# Altium project PFC_Stage.PrjPcb (part 1 of 3)
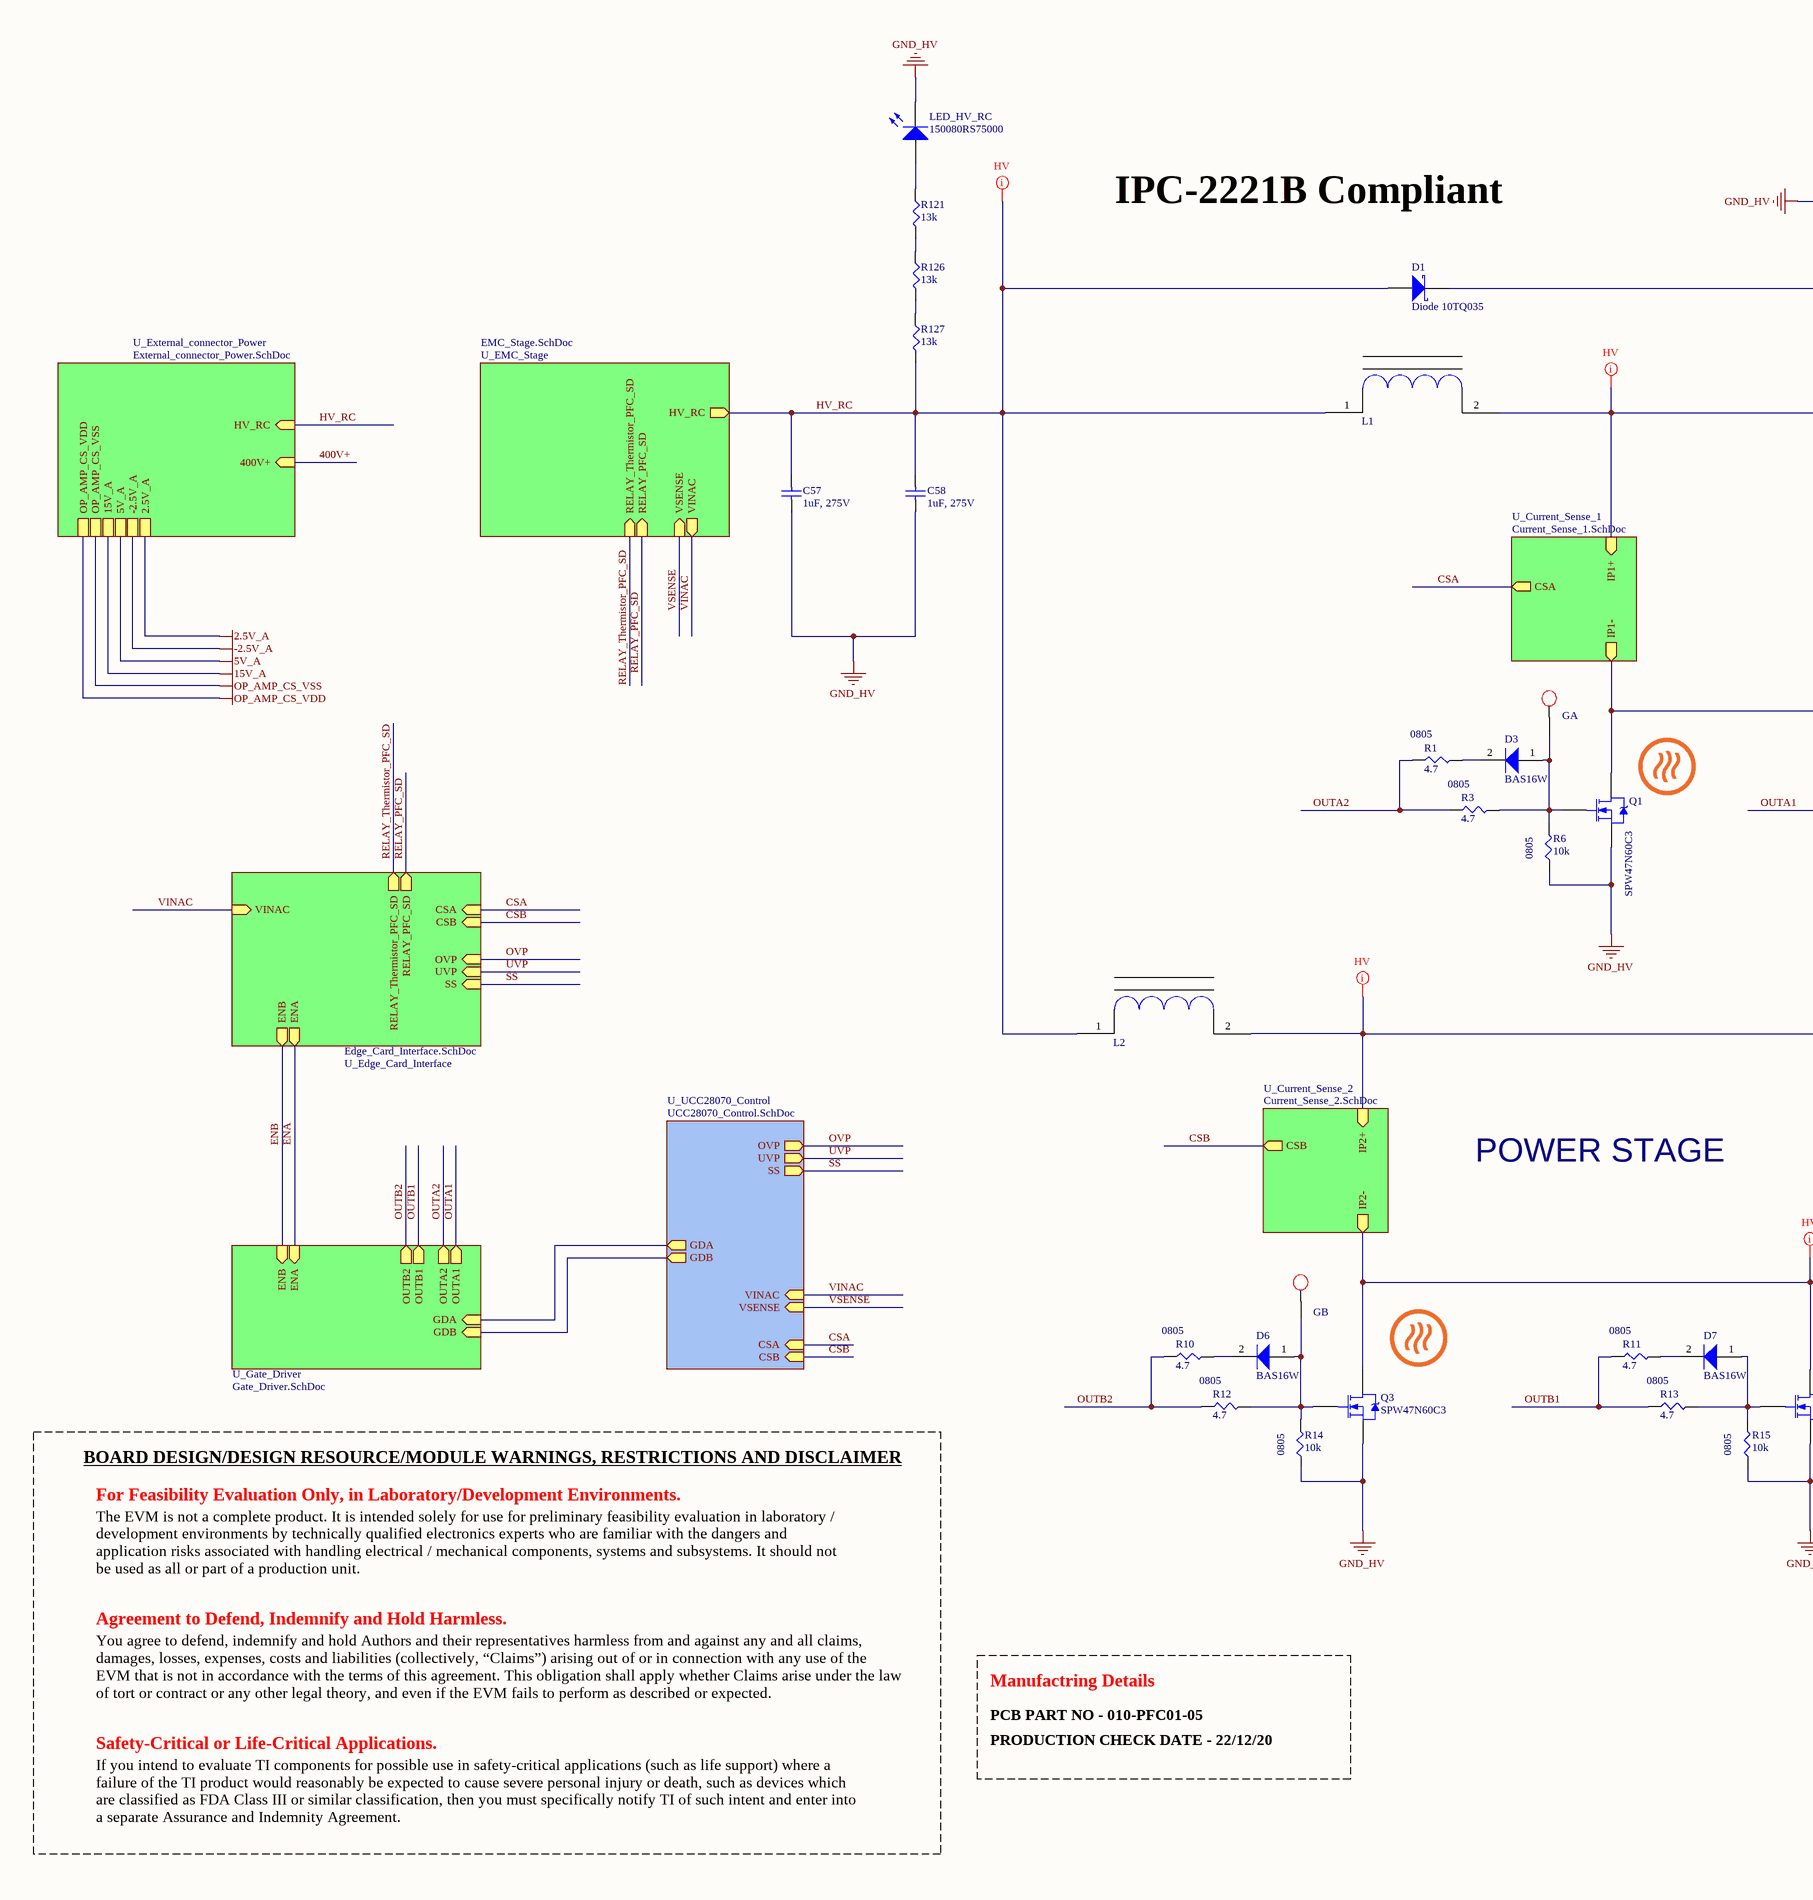
[diagram p0: PFC_Stage.SchDoc, left]
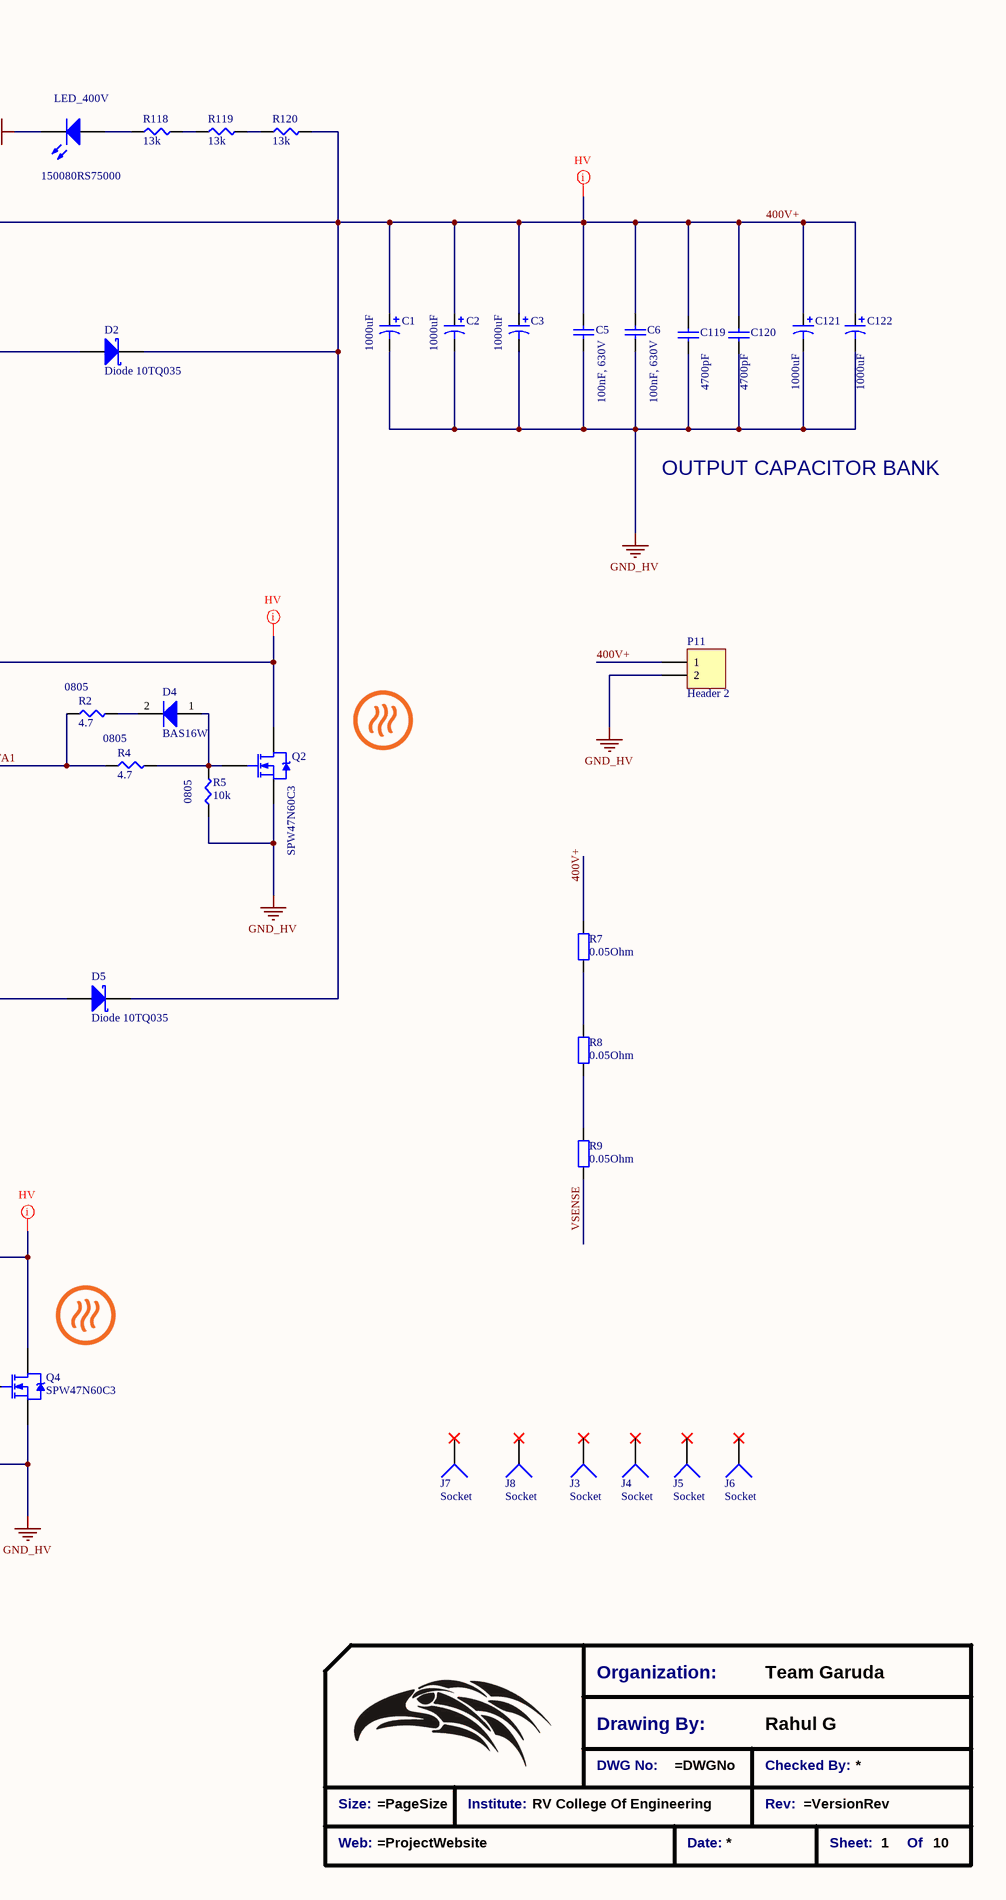
[diagram p1: PFC_Stage.SchDoc, right]
10 sheets, 562 parts. Net scope: hierarchical (ports join the sheet entries above them; power ports are global).
Board file: PFC_Stage.PcbDoc
Sheets:
  PFC_Stage.SchDoc
    U_UCC28070_Control = UCC28070_Control.SchDoc
      U_Shut_Down = Shut_Down.SchDoc
    U_Current_Sense_1 = Current_Sense_1.SchDoc
    U_Current_Sense_2 = Current_Sense_2.SchDoc
    U_Gate_Driver = Gate_Driver.SchDoc
    U_EMC_Stage = EMC_Stage.SchDoc
    U_External_connector_Power = External_connector_Power.SchDoc
    U_Edge_Card_Interface = Edge_Card_Interface.SchDoc
      U_AC mains Sensing = AC mains Sensing.SchDoc

## Sheet PFC_Stage.SchDoc
size A2; Author: Rahul G; DrawnBy: Rahul G; Engineer: Rahul G; DocumentNumber: 1; SheetNumber: 1; SheetTotal: 10

### Parts
*  Title_Block  (value not drawn)  (graphical)
C1  value 1000uF  [450V_40mm_10mm]  (hidden comment: 40mm)
C2  value 1000uF  [450V_40mm_10mm]  (hidden comment: 40mm)
C3  value 1000uF  [450V_40mm_10mm]  (hidden comment: 40mm)
C5  100nF, 630V  [L18_W6_H12_P15]
C6  100nF, 630V  [L18_W6_H12_P15]
C57  1uF, 275V  [L26_W11_H20_P22.5_CS]
C58  1uF, 275V  [L26_W11_H20_P22.5_CS]
C119  value 4700pF  [VY1472M61Y5UC63V0]  (hidden comment: VY1472M61Y5UC63V0)
C120  value 4700pF  [VY1472M61Y5UC63V0]  (hidden comment: VY1472M61Y5UC63V0)
C121  value 1000uF  [450V_40mm_10mm]  (hidden comment: 40mm)
C122  value 1000uF  [450V_40mm_10mm]  (hidden comment: 40mm)
D1  Diode 10TQ035  [INF-PG-TO247-2-MOD]
D2  Diode 10TQ035  [INF-PG-TO247-2-MOD]
D3  BAS16W  [SODFL250X110-2N]
D4  BAS16W  [SODFL250X110-2N]
D5  Diode 10TQ035  [INF-PG-TO247-2-MOD]
D6  BAS16W  [SODFL250X110-2N]
D7  BAS16W  [SODFL250X110-2N]
GA  Test Point  [Test_point_SMD]  (value not drawn)  (no BOM)
GB  Test Point  [Test_point_SMD]  (value not drawn)  (no BOM)
J3  Socket  [Mounting_hole_3mm]
J4  Socket  [Mounting_hole_3mm]
J5  Socket  [Mounting_hole_3mm]
J6  Socket  [Mounting_hole_3mm]
J7  Socket  [Mounting_hole_3mm_no_body]
J8  Socket  [Mounting_hole_3mm_no_body]
L1  Transformer_Inductor  [PFC_Toroid_MPP]  (value not drawn)
L2  Transformer_Inductor  [PFC_Toroid_MPP]  (value not drawn)
LED_400V  150080RS75000  [0805_A]
LED_HV_RC  150080RS75000  [0805_A]
P11  Header 2  [Barrier_Strip_2]
Q1  SPW47N60C3  [INF-PG-TO247-3-44]
Q2  SPW47N60C3  [INF-PG-TO247-3-44]
Q3  SPW47N60C3  [INF-PG-TO247-3-44]
Q4  SPW47N60C3  [INF-PG-TO247-3-44]
R1  4.7  Supplier Device Package: 0805  [SMD-0805-RES]
R2  4.7  Supplier Device Package: 0805  [SMD-0805-RES]
R3  4.7  Supplier Device Package: 0805  [SMD-0805-RES]
R4  4.7  Supplier Device Package: 0805  [SMD-0805-RES]
R5  10k  Supplier Device Package: 0805  [SMD-0805-RES]
R6  10k  Supplier Device Package: 0805  [SMD-0805-RES]
R7  0.05Ohm  [WRIS-KSKE_1206_H=0.6mm]
R8  0.05Ohm  [WRIS-KSKE_1206_H=0.6mm]
R9  0.05Ohm  [WRIS-KSKE_1206_H=0.6mm]
R10  4.7  Supplier Device Package: 0805  [SMD-0805-RES]
R11  4.7  Supplier Device Package: 0805  [SMD-0805-RES]
R12  4.7  Supplier Device Package: 0805  [SMD-0805-RES]
R13  4.7  Supplier Device Package: 0805  [SMD-0805-RES]
R14  10k  Supplier Device Package: 0805  [SMD-0805-RES]
R15  10k  Supplier Device Package: 0805  [SMD-0805-RES]
R118  13k  [SMD-2512-RES]
R119  13k  [SMD-2512-RES]
R120  13k  [SMD-2512-RES]
R121  13k  [SMD-2512-RES]
R126  13k  [SMD-2512-RES]
R127  13k  [SMD-2512-RES]

### Sub-sheets
U_Current_Sense_1 = Current_Sense_1.SchDoc: CSA (out), IP1+ (in), IP1- (out)
U_Current_Sense_2 = Current_Sense_2.SchDoc: CSB (out), IP2+ (in), IP2- (out)
U_Edge_Card_Interface = Edge_Card_Interface.SchDoc: OVP (in), UVP (in), CSA (in), CSB (in), SS (in), RELAY_PFC_SD (out), RELAY_Thermistor_PFC_SD (out), ENB (out), ENA (out), VINAC (in)
U_EMC_Stage = EMC_Stage.SchDoc: RELAY_PFC_SD (in), HV_RC (out), VINAC (out), VSENSE (in), RELAY_Thermistor_PFC_SD (in)
U_External_connector_Power = External_connector_Power.SchDoc: 400V+ (in), OP_AMP_CS_VDD, -2.5V_A, 15V_A, OP_AMP_CS_VSS, 5V_A, 2.5V_A, HV_RC (in)
U_Gate_Driver = Gate_Driver.SchDoc: GDB (in), GDA (in), ENB (in), ENA (in), OUTA2 (out), OUTB2 (out), OUTB1 (out), OUTA1 (out)
U_UCC28070_Control = UCC28070_Control.SchDoc: GDB (out), CSA (in), CSB (in), VINAC (in), GDA (out), VSENSE (in), OVP (out), UVP (out), SS (out)

### Nets
GND_HV: C1.2 C2.2 C3.2 C5.1 C6.1 C57.1 C58.1 C119.1 C120.1 C121.2 C122.2 LED_400V.1(K) LED_HV_RC.1(K) P11.2 Q1.3(S) Q2.3(S) Q3.3(S) Q4.3(S) R5.1 R6.1 R14.1 R15.1
400V+: C1.1 C2.1 C3.1 C5.2 C6.2 C119.2 C120.2 C121.1 C122.1 D1.1(K) D2.1(K) D5.1(K) P11.1 R7.2 R120.2 ; sheet U_External_connector_Power/400V+
CSA: sheet U_UCC28070_Control/CSA, sheet U_Current_Sense_1/CSA, sheet U_Edge_Card_Interface/CSA
CSB: sheet U_UCC28070_Control/CSB, sheet U_Current_Sense_2/CSB, sheet U_Edge_Card_Interface/CSB
ENA: sheet U_Gate_Driver/ENA, sheet U_Edge_Card_Interface/ENA
ENB: sheet U_Gate_Driver/ENB, sheet U_Edge_Card_Interface/ENB
GDA: sheet U_UCC28070_Control/GDA, sheet U_Gate_Driver/GDA
GDB: sheet U_UCC28070_Control/GDB, sheet U_Gate_Driver/GDB
HV_RC: C57.2 C58.2 D1.3(A) L1.1 L2.1 R127.2 ; sheet U_EMC_Stage/HV_RC, sheet U_External_connector_Power/HV_RC
OUTA1: R2.1 R4.1 ; sheet U_Gate_Driver/OUTA1
OUTA2: R1.1 R3.1 ; sheet U_Gate_Driver/OUTA2
OUTB1: R11.1 R13.1 ; sheet U_Gate_Driver/OUTB1
OUTB2: R10.1 R12.1 ; sheet U_Gate_Driver/OUTB2
OVP: sheet U_UCC28070_Control/OVP, sheet U_Edge_Card_Interface/OVP
RELAY_PFC_SD: sheet U_EMC_Stage/RELAY_PFC_SD, sheet U_Edge_Card_Interface/RELAY_PFC_SD
RELAY_Thermistor_PFC_SD: sheet U_EMC_Stage/RELAY_Thermistor_PFC_SD, sheet U_Edge_Card_Interface/RELAY_Thermistor_PFC_SD
SS: sheet U_UCC28070_Control/SS, sheet U_Edge_Card_Interface/SS
UVP: sheet U_UCC28070_Control/UVP, sheet U_Edge_Card_Interface/UVP
VINAC: sheet U_UCC28070_Control/VINAC, sheet U_EMC_Stage/VINAC, sheet U_Edge_Card_Interface/VINAC
VSENSE: R9.1 ; sheet U_UCC28070_Control/VSENSE, sheet U_EMC_Stage/VSENSE
NetD2_3: D2.3(A) L1.2 ; sheet U_Current_Sense_1/IP1+
NetD3_1: D3.1(A) GA.1 Q1.1(G) R3.2 R6.2
NetD3_2: D3.2(K) R1.2
NetD4_1: D4.1(A) Q2.1(G) R4.2 R5.2
NetD4_2: D4.2(K) R2.2
NetD5_3: D5.3(A) L2.2 ; sheet U_Current_Sense_2/IP2+
NetD6_1: D6.1(A) GB.1 Q3.1(G) R12.2 R14.2
NetD6_2: D6.2(K) R10.2
NetD7_1: D7.1(A) Q4.1(G) R13.2 R15.2
NetD7_2: D7.2(K) R11.2
NetLED_400V_2: LED_400V.2(A) R118.1
NetLED_HV_RC_2: LED_HV_RC.2(A) R121.1
NetQ1_2: Q1.2(D) Q2.2(D) ; sheet U_Current_Sense_1/IP1-
NetQ3_2: Q3.2(D) Q4.2(D) ; sheet U_Current_Sense_2/IP2-
NetR7_1: R7.1 R8.2
NetR8_1: R8.1 R9.2
NetR118_2: R118.2 R119.1
NetR119_2: R119.2 R120.1
NetR121_2: R121.2 R126.1
NetR126_2: R126.2 R127.1

Not connected (* = marked no-connect by the designer): J3 1*; J4 1*; J5 1*; J6 1*; J7 1*; J8 1*

### Layout directives
net class HV; rule Clearance Constraint [Generic clearance = 50mil, and 18 value(s) for objects]: 400V+, HV_RC, NetD2_3, NetD5_3, NetQ1_2, NetQ3_2

### Notes on the sheet
- IPC-2221B Compliant
- OUTPUT CAPACITOR BANK
- POWER STAGE
- BOARD DESIGN/DESIGN RESOURCE/MODULE WARNINGS, RESTRICTIONS AND DISCLAIMER
- For Feasibility Evaluation Only, in Laboratory/Development Environments.
- The EVM is not a complete product. It is intended solely for use for preliminary feasibility evaluation in laboratory / development environments by technically qualified electronics experts who are familiar with the dangers and application risks associated with handling electrical / mechanical components, systems and subsystems. It should not be used as all or part of a production unit.
- Agreement to Defend, Indemnify and Hold Harmless.
- You agree to defend, indemnify and hold Authors and their representatives harmless from and against any and all claims, damages, losses, expenses, costs and liabilities (collectively, “Claims”) arising out of or in connection with any use of the
  EVM that is not in accordance with the terms of this agreement. This obligation shall apply whether Claims arise under the law of tort or contract or any other legal theory, and even if the EVM fails to perform as described or expected.
- Manufactring Details
- PCB PART NO - 010-PFC01-05
- Safety-Critical or Life-Critical Applications.
- PRODUCTION CHECK DATE - 22/12/20
- If you intend to evaluate TI components for possible use in safety-critical applications (such as life support) where a failure of the TI product would reasonably be expected to cause severe personal injury or death, such as devices which are classified as FDA Class III or similar classification, then you must specifically notify TI of such intent and enter into a separate Assurance and Indemnity Agreement.
- (in symbol Title_Block) Organization:; Team Garuda; Drawing By:; DWG No:; Checked By:; Size:; Institute:; RV College Of Engineering; Rev:; Web:; Date:; Sheet:; Of

### Library data of the parts
* = Title_Block: Standard Title Block
C1-C3 C121 C122 = Cap Pol1: Polarized Capacitor (Radial); Published: 8-Jun-2000; LatestRevisionDate: 17-Jul-2002; LatestRevisionNote: Re-released for DXP Platform.; PackageReference: RB7.6-15; Publisher: Altium Limited; PackageDescription: Polarized Capacitor (Radial); 2 Leads
C5 C6 = 890303425004CS: WCAP-FTBE THT Film Capacitors, 100nF, 630VDC; Insulation Resistance: 9000MOhm; Dissipation Factor@100kHz: 3.2%; Dissipation Factor@1kHz: 1%; Dissipation Factor@10kHz: 1.4%; Pitch: 15mm; Rate of Voltage Rise: 28V/us; Technical Reference: MPSP015104K630DCPP45004; ComponentLink1Description: Manufacturer; ComponentLink1URL: http://www.we-online.de; ComponentLink2Description: Datasheet; ComponentLink2URL: https://katalog.we-online.com/pbs/datasheet/890303425004CS.pdf; Length: 18mm; Mounting Technology: THT; Packaging: Carton; Part Number: 890303425004CS; Operating Temperature: -40 to +85degC; Width: 6mm; Capacitance: 100nF; Height: 12mm; Rated Voltage: 630VDC; Publisher: Wurth Elektronik; Published Date: August 2019
C57 C58 = 890324026027CS: WCAP-FTX2 THT Film Capacitors, 1uF, 275VAC; Insulation Resistance: 10000Ohm x F; Dissipation Factor@1kHz: 0.1%; Dissipation Factor@10kHz: 0.7%; Pitch: 22.5mm; Rate of Voltage Rise: 170V/us; Technical Reference: MX2P225105K275ACPP36004; ComponentLink1Description: Manufacturer; ComponentLink1URL: http://www.we-online.de; ComponentLink2Description: Datasheet; ComponentLink2URL: https://katalog.we-online.com/pbs/datasheet/890324026027CS.pdf; Length: 26mm; Mounting Technology: THT; Packaging: Bulk and Carton; Part Number: 890324026027CS; Operating Temperature: -40 to +105degC; Width: 11mm; Capacitance: 1uF; Dissipation Factor@100kHz: -; Height: 20mm; Rated Voltage: 275VAC; Publisher: Wurth Elektronik; Published Date: August 2019
C119 C120 = VY1472M61Y5UC63V0: Capacitor; Published: 8-Jun-2000; LatestRevisionDate: 17-Jul-2002; LatestRevisionNote: Re-released for DXP Platform.; PackageReference: RAD-0.3; Publisher: Altium Limited; PackageDescription: Radial Cap, Thru-Hole; 2 Leads; 0.3 in Pin Spacing
D1 D2 D5 = Diode 10TQ035: Schottky Rectifier; Note: Terminal 2 is the TAB and is electrically connected to the cathode; Published: 8-Jun-2000; LatestRevisionDate: 17-Jul-2002; LatestRevisionNote: Re-released for DXP Platform.; DatasheetVersion: PD-2.057B; PackageVersion: Feb-1998; PackageReference: TO-220AC; Publisher: Altium Limited; PackageDescription: TO, Thru-Hole, Vertical, Heatsink Mounted; 3 In-Line Leads (1 Absent); Pitch 2.54 mm; ComponentLink1Description: Manufacturer Link; ComponentLink1URL: http://www.irf.com/; ComponentLink2Description: Datasheet; ComponentLink2URL: http://www.irf.com/product-info/datasheets/data/10tq.pdf
D3 D4 D6 D7 = BAS16_SOD: Silicon Switching Diode, SOT323, Reel, Green; Manufacturer: Infineon; IR (max): 100Â nA; Configuration: Single; VBR (min): 85Â V; VR (max): 80Â V; trr (max): 4Â ns; Green: TRUE; VF (max): 1.25Â V; IF (max): 250Â mA; Mounting Technology: Surface Mount; PackageReference: SOT323; ComponentLink2URL: http://www.infineon.com/dgdl/bas16series.pdf?folderId=db3a30431400ef6801141b5844e103ea&fileId=db3a30431400ef6801141b93811b03ff; Halogen-free: TRUE; ComponentLink2Description: Datasheet; PartNumber: BAS16W; ComponentLink1Description: Manufacturer URL; ComponentLink3URL: http://www.infineon.com/dgdl/SOT323-Package_Overview.pdf?folderId=db3a30431936bc4b0119533e1dcb3c92&fileId=db3a30431936bc4b011953495f283cb1; ComponentLink1URL: http://www.infineon.com/; PackageDescription: 3-Pin Small Outline Transistor Package, 1.25 x 2 mm Body, 0.65 mm Pitch; ComponentLink3Description: Package Specification
GA GB = Test Point: TP
LED_400V LED_HV_RC = 150080RS75000: SMD mono-color Chip LED, WL-SMCW, Red; PackageReference: 0805_A; Color: Red; PartNumber: 150080RS75000; ComponentLink1Description: Manufacturer URL; ComponentLink1URL: http://www.we-online.com; ComponentLink2Description: Datasheet; ComponentLink2URL: http://katalog.we-online.com/led/datasheet/150080RS75000.pdf
P11 = Header 2: Header, 2-Pin; LatestRevisionDate: 17-Jul-2002; LatestRevisionNote: Re-released for DXP Platform.; Publisher: Altium Limited
Q1-Q4 = NMOS-2: N-Channel Power MOSFET; Note: Pin 2 is electrically connected to pin 4.; Published: 8-Jun-2000; LatestRevisionDate: 17-Jul-2002; LatestRevisionNote: Re-released for DXP Platform.; DatasheetVersion: PD-9.814; PackageVersion: Feb-1997; PackageReference: TO-220AB; Publisher: Altium Limited; PackageDescription: TO, Thru-Hole, Vertical, Heatsink Mounted; 3 In-Line Leads; Pitch 2.54 mm; ComponentLink1Description: Manufacturer Link; ComponentLink1URL: http://www.irf.com/
R1-R4 R10-R13 = ERJ-6BQF4R7V: RES SMD 4.7 OHM 1% 1/3W 0805; Manufacturer: Panasonic Electronic Components; Factory Stock: 0; Unit Price (USD): 0.07013; @ qty: 1500; Minimum Quantity: 1; Power (Watts): 0.333W, 1/3W; Temperature Coefficient: ±200ppm/°C; Part Number: ERJ-6BQF4R7V; Datasheets: https://industrial.panasonic.com/cdbs/www-data/pdf/RDA0000/AOA0000C239.pdf; Image: //media.digikey.com/Renders/Panasonic%20Renders/ERJ-0805%20Pkg.jpg; Digi-Key Part Number: P15995CT-ND; Quantity Available: 9150; Packaging: Cut Tape (CT); Series: ERJ; Part Status: Active; Value: 4.7; Tolerance: ±1%; Composition: Thick Film; Features: Automotive AEC-Q200, Current Sense; Operating Temperature: -55°C ~ 125°C; Package / Case: 0805 (2012 Metric); Size / Dimension: 0.079" L x 0.049" W (2.00mm x 1.25mm); Height - Seated (Max): 0.028" (0.70mm); Number of Terminations: 2; Failure Rate: -
R5 R6 R14 R15 = ERJ-6ENF1002V: RES SMD 10K OHM 1% 1/8W 0805; Manufacturer: Panasonic Electronic Components; Factory Stock: 0; Unit Price (USD): 0.00729; @ qty: 1500; Minimum Quantity: 1; Power (Watts): 0.125W, 1/8W; Temperature Coefficient: ±100ppm/°C; Part Number: ERJ-6ENF1002V; Datasheets: http://industrial.panasonic.com/www-cgi/jvcr13pz.cgi?E+PZ+3+AOA0002+ERJ6ENF1002V+7+WW; Image: //media.digikey.com/Renders/Panasonic%20Renders/ERJ-0805%20Pkg.jpg; Digi-Key Part Number: P10.0KCCT-ND; Quantity Available: 3985614; Packaging: Cut Tape (CT); Series: ERJ; Part Status: Active; Value: 10k; Tolerance: ±1%; Composition: Thick Film; Features: Automotive AEC-Q200; Operating Temperature: -55°C ~ 155°C; Package / Case: 0805 (2012 Metric); Size / Dimension: 0.079" L x 0.049" W (2.00mm x 1.25mm); Height - Seated (Max): 0.028" (0.70mm); Number of Terminations: 2; Failure Rate: -
R7-R9 = 560050332001: WRIS-KSKE Thick Film Resistors, size 1206, 0.05Ohm, +/-1%, 0.5W; Rated Current: 3.16A; Temperature Coefficient of Resistance: 250ppm/degC; Technical Reference: KE1206R050F102LAATP0000; ComponentLink1Description: Manufacturer; ComponentLink1URL: http://www.we-online.de; ComponentLink2Description: Datasheet; ComponentLink2URL: https://katalog.we-online.com/pbs/datasheet/560050332001.pdf; Publisher: Wurth Elektronik; Rated Power: 0.5W; Resistance: 0.05Ohm; Mounting Technology: SMT; Height: 0.6mm; Part Number: 560050332001; Packaging: Tape and Reel; Published Date: September 2019; Size: 1206; Length: 3.1mm; Operating Temperature: -55 to +155degC; Resistance Tolerance: +/-1%; Width: 1.6mm
R118-R121 R126 R127 = ERJ-1TNF1302U: RES SMD 13K OHM 1% 1W 2512; Manufacturer: Panasonic Electronic Components; Factory Stock: 0; Unit Price (USD): 0.14799; @ qty: 1500; Minimum Quantity: 1; Temperature Coefficient: ±100ppm/°C; Part Number: ERJ-1TNF1302U; Datasheets: http://industrial.panasonic.com/www-cgi/jvcr13pz.cgi?E+PZ+3+AOA0002+ERJ1TNF1302U+7+WW; Image: //media.digikey.com/Renders/Panasonic%20Renders/ERJ-2512%20Pkg.jpg; Digi-Key Part Number: PT13.0KAFCT-ND; Quantity Available: 2142; Packaging: Cut Tape (CT); Series: ERJ; Part Status: Active; Value: 13k; Tolerance: ±1%; Power (Watts): 1W; Composition: Thick Film; Features: Automotive AEC-Q200; Operating Temperature: -55°C ~ 155°C; Package / Case: 2512 (6432 Metric); Supplier Device Package: 2512; Size / Dimension: 0.252" L x 0.126" W (6.40mm x 3.20mm); Height - Seated (Max): 0.028" (0.70mm); Number of Terminations: 2; Failure Rate: -
J3-J8 = Socket: LatestRevisionDate: 17-Jul-2002; LatestRevisionNote: Re-released for DXP Platform.; Publisher: Altium Limited

## Sheet UCC28070_Control.SchDoc
size A2
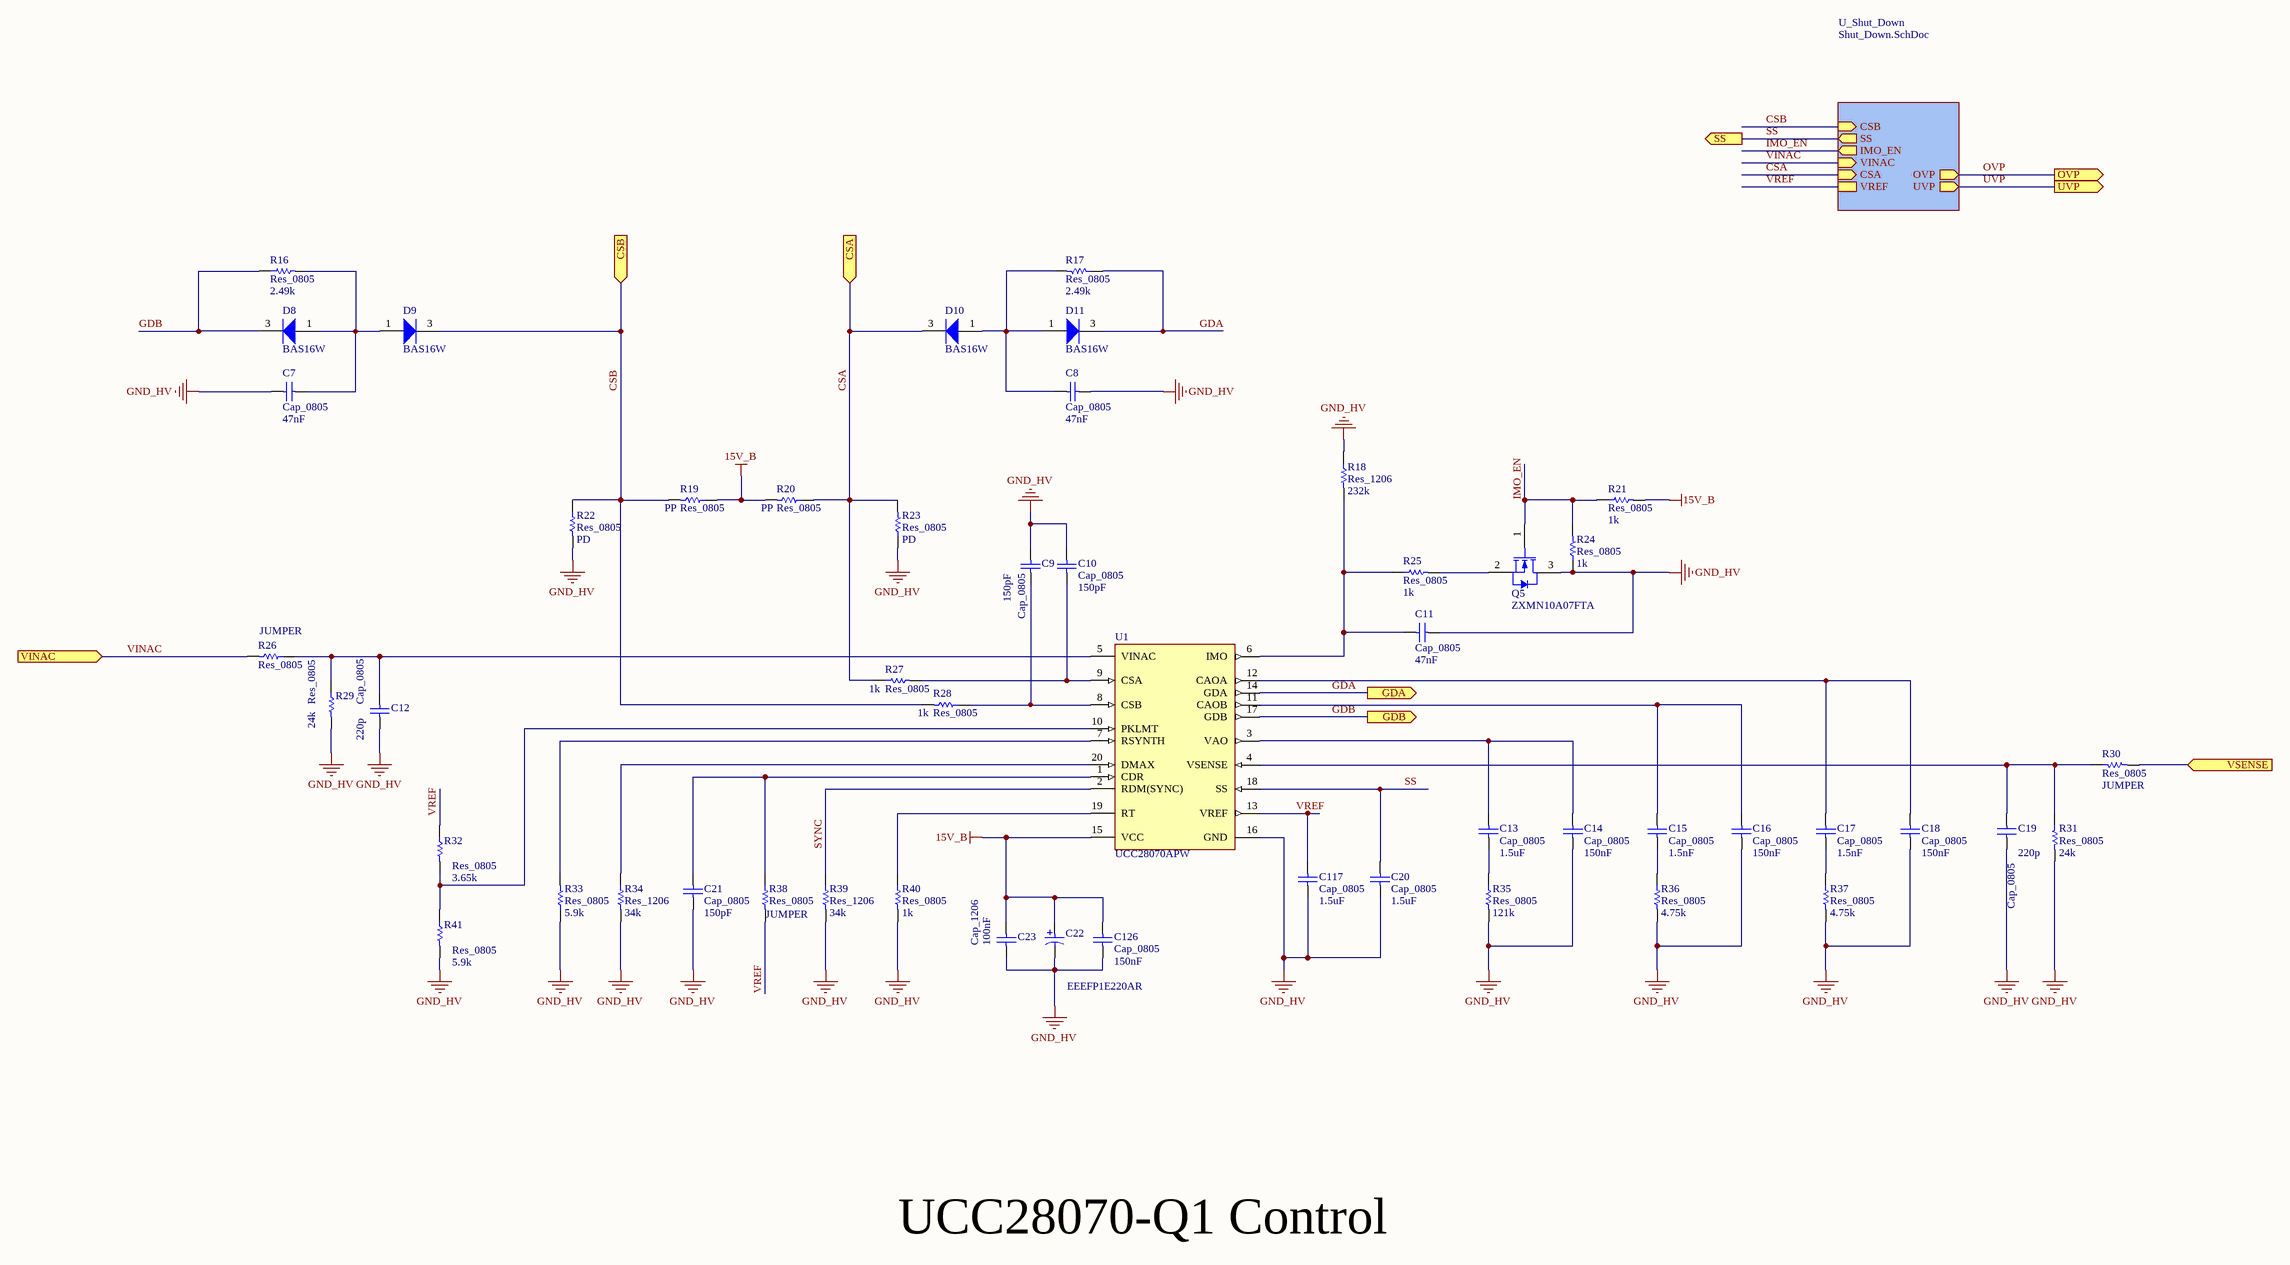
[diagram p2: UCC28070_Control.SchDoc]

### Parts
C7  Cap_0805  Size: 47nF  [SMD-0805C]
C8  Cap_0805  Size: 47nF  [SMD-0805C]
C9  Cap_0805  Size: 150pF  [SMD-0805C]
C10  Cap_0805  Size: 150pF  [SMD-0805C]
C11  Cap_0805  Size: 47nF  [SMD-0805C]
C12  Cap_0805  Size: 220p  [SMD-0805C]
C13  Cap_0805  Size: 1.5uF  [SMD-0805C]
C14  Cap_0805  Size: 150nF  [SMD-0805C]
C15  Cap_0805  Size: 1.5nF  [SMD-0805C]
C16  Cap_0805  Size: 150nF  [SMD-0805C]
C17  Cap_0805  Size: 1.5nF  [SMD-0805C]
C18  Cap_0805  Size: 150nF  [SMD-0805C]
C19  Cap_0805  Size: 220p  [SMD-0805C]
C20  Cap_0805  Size: 1.5uF  [SMD-0805C]
C21  Cap_0805  Size: 150pF  [SMD-0805C]
C22  EEEFP1E220AR  [PNSC-FP-V-C_V]
C23  Cap_1206  value 100nF  [SMD-1206C]
C117  Cap_0805  Size: 1.5uF  [SMD-0805C]
C126  Cap_0805  Size: 150nF  [SMD-0805C]
D8  BAS16W  [SOT95P278X110-3N]
D9  BAS16W  [SOT95P278X110-3N]
D10  BAS16W  [SOT95P278X110-3N]
D11  BAS16W  [SOT95P278X110-3N]
Q5  ZXMN10A07FTA  [DIOD-SOT23-3_D_V]
R16  Res_0805  value 2.49k  [WRIS-KSKE_0805_H=0.6mm]
R17  Res_0805  value 2.49k  [WRIS-KSKE_0805_H=0.6mm]
R18  Res_1206  value 232k  [WRIS-KSKE_1206_H=0.6mm]
R19  Res_0805  value PP  [WRIS-KSKE_0805_H=0.6mm]
R20  Res_0805  value PP  [WRIS-KSKE_0805_H=0.6mm]
R21  Res_0805  value 1k  [WRIS-KSKE_0805_H=0.6mm]
R22  Res_0805  value PD  [WRIS-KSKE_0805_H=0.6mm]
R23  Res_0805  value PD  [WRIS-KSKE_0805_H=0.6mm]
R24  Res_0805  value 1k  [WRIS-KSKE_0805_H=0.6mm]
R25  Res_0805  value 1k  [WRIS-KSKE_0805_H=0.6mm]
R26  Res_0805  value JUMPER  [WRIS-KSKE_0805_H=0.6mm]
R27  Res_0805  value 1k  [WRIS-KSKE_0805_H=0.6mm]
R28  Res_0805  value 1k  [WRIS-KSKE_0805_H=0.6mm]
R29  Res_0805  value 24k  [WRIS-KSKE_0805_H=0.6mm]
R30  Res_0805  value JUMPER  [WRIS-KSKE_0805_H=0.6mm]
R31  Res_0805  value 24k  [WRIS-KSKE_0805_H=0.6mm]
R32  Res_0805  value 3.65k  [WRIS-KSKE_0805_H=0.6mm]
R33  Res_0805  value 5.9k  [WRIS-KSKE_0805_H=0.6mm]
R34  Res_1206  value 34k  [WRIS-KSKE_1206_H=0.6mm]
R35  Res_0805  value 121k  [WRIS-KSKE_0805_H=0.6mm]
R36  Res_0805  value 4.75k  [WRIS-KSKE_0805_H=0.6mm]
R37  Res_0805  value 4.75k  [WRIS-KSKE_0805_H=0.6mm]
R38  Res_0805  value JUMPER  [WRIS-KSKE_0805_H=0.6mm]
R39  Res_1206  value 34k  [WRIS-KSKE_1206_H=0.6mm]
R40  Res_0805  value 1k  [WRIS-KSKE_0805_H=0.6mm]
R41  Res_0805  value 5.9k  [WRIS-KSKE_0805_H=0.6mm]
U1  UCC28070APW  [TSOP65P640X120_HS-21N]

### Sub-sheets
U_Shut_Down = Shut_Down.SchDoc: CSB (in), SS (out), IMO_EN (out), VINAC (in), CSA (in), VREF, OVP (out), UVP (out)

### Ports
CSA (in), CSB (in), GDA (out), GDB (out), OVP (out), SS (out), UVP (out), VINAC (in), VSENSE (in)

### Nets
15V_B: C22.1 C23.1 C126.1 R19.1 R20.2 R21.2 U1.15(VCC)
GND_HV: C7.1 C8.1 C9.1 C10.1 C11.2 C12.2 C14.2 C16.2 C18.2 C19.2 C20.2 C21.2 C22.2 C23.2 C117.2 C126.2 Q5.3(D) R18.1 R22.2 R23.1 R24.1 R29.2 R31.2 R33.1 R34.2 R35.2 R36.2 R37.2 R39.2 R40.2 R41.2 U1.16(GND)
CSA: D10.3(K) R20.1 R23.2 R27.1 ; port CSA, sheet U_Shut_Down/CSA
CSB: D9.3(K) R19.2 R22.1 R28.2 ; port CSB, sheet U_Shut_Down/CSB
GDA: D11.3(K) R17.1 U1.14(GDA) ; port GDA
GDB: D8.3(K) R16.1 U1.17(GDB) ; port GDB
IMO_EN: Q5.1(G) R21.1 R24.2 ; sheet U_Shut_Down/IMO_EN
OVP: port OVP, sheet U_Shut_Down/OVP
SS: C20.1 U1.18(SS) ; port SS, sheet U_Shut_Down/SS
SYNC: R39.1 U1.2(RDM(SYNC))
UVP: port UVP, sheet U_Shut_Down/UVP
VINAC: R26.2 ; port VINAC, sheet U_Shut_Down/VINAC
VREF: C117.1 R32.1 R38.2 U1.13(VREF) ; sheet U_Shut_Down/VREF
VSENSE: R30.2 ; port VSENSE
NetC7_2: C7.2 D8.1(A) D9.1(A) R16.2
NetC8_2: C8.2 D10.1(A) D11.1(A) R17.2
NetC9_2: C9.2 R28.1 U1.8(CSB)
NetC10_2: C10.2 R27.2 U1.9(CSA)
NetC11_1: C11.1 R18.2 R25.1 U1.6(IMO)
NetC12_1: C12.1 R26.1 R29.1 U1.5(VINAC)
NetC13_1: C13.1 C14.1 U1.3(VAO)
NetC13_2: C13.2 R35.1
NetC15_1: C15.1 C16.1 U1.11(CAOB)
NetC15_2: C15.2 R36.1
NetC17_1: C17.1 C18.1 U1.12(CAOA)
NetC17_2: C17.2 R37.1
NetC19_1: C19.1 R30.1 R31.1 U1.4(VSENSE)
NetC21_1: C21.1 R38.1 U1.1(CDR)
NetQ5_2: Q5.2(S) R25.2
NetR32_2: R32.2 R41.1 U1.10(PKLMT)
NetR33_2: R33.2 U1.7(RSYNTH)
NetR34_1: R34.1 U1.20(DMAX)
NetR40_1: R40.1 U1.19(RT)

### Notes on the sheet
- UCC28070-Q1 Control

### Library data of the parts
C7-C15 C17 C19-C21 C117 = Cap: Capacitor; Value: 100pF; Published: 8-Jun-2000; LatestRevisionDate: 17-Jul-2002; LatestRevisionNote: Re-released for DXP Platform.; PackageReference: RAD-0.3; Publisher: Altium Limited; PackageDescription: Radial Cap, Thru-Hole; 2 Leads; 0.3 in Pin Spacing
C16 C18 C126 = Cap: Capacitor; Value: 330pF; Published: 8-Jun-2000; LatestRevisionDate: 17-Jul-2002; LatestRevisionNote: Re-released for DXP Platform.; PackageReference: RAD-0.3; Publisher: Altium Limited; PackageDescription: Radial Cap, Thru-Hole; 2 Leads; 0.3 in Pin Spacing
C22 = CMP-2000-06213-1: Aluminum Electrolytic Capacitor, 22 uF, +/- 20%, 25 V, 2-Pin SMD (Size Code C), -55 to 105 degC, RoHS, Tape and Reel; Manufacturer: Panasonic; ESR (Equivalent Series Resistance): 0.36O; Ripple Current: 240mA; Capacitance: 22µF; Lifetime@Temperature: 2000Hrs@105°C; Rated Voltage: 25V; Type: Can; Package Reference: FP-V-C; Package Description: 2-Pin Electrolytic Aluminum Capacitor, Body 5.3 x 5.3 mm; Operating Temp Range: -55to+105°C; Mounting Technology: SurfaceMount; Datasheet URL: http://industrial.panasonic.com/cdbs/www-data/pdf/RDE0000/ABA0000C1184.pdf; Case Size/Dimension: Ø5x5.8mm; Operating Temp-Max: 105°C; Package URL: http://industrial.panasonic.com/cdbs/www-data/pdf/RDE0000/DME0000COL48.pdf; Datasheet Version: 03/2016; Series: FP; Manufacturer URL: http://www.panasonic.com/
C23 = Cap: Capacitor; Published: 8-Jun-2000; LatestRevisionDate: 17-Jul-2002; LatestRevisionNote: Re-released for DXP Platform.; PackageReference: RAD-0.3; Publisher: Altium Limited; PackageDescription: Radial Cap, Thru-Hole; 2 Leads; 0.3 in Pin Spacing
D8-D11 = BAS16: Silicon Switching Diode, SOT323, Reel, Green; Manufacturer: Infineon; IR (max): 100Â nA; Configuration: Single; VBR (min): 85Â V; VR (max): 80Â V; trr (max): 4Â ns; Green: TRUE; VF (max): 1.25Â V; IF (max): 250Â mA; Mounting Technology: Surface Mount; PackageReference: SOT323; ComponentLink2URL: http://www.infineon.com/dgdl/bas16series.pdf?folderId=db3a30431400ef6801141b5844e103ea&fileId=db3a30431400ef6801141b93811b03ff; Halogen-free: TRUE; ComponentLink2Description: Datasheet; PartNumber: BAS16W; ComponentLink1Description: Manufacturer URL; ComponentLink3URL: http://www.infineon.com/dgdl/SOT323-Package_Overview.pdf?folderId=db3a30431936bc4b0119533e1dcb3c92&fileId=db3a30431936bc4b011953495f283cb1; ComponentLink1URL: http://www.infineon.com/; PackageDescription: 3-Pin Small Outline Transistor Package, 1.25 x 2 mm Body, 0.65 mm Pitch; ComponentLink3Description: Package Specification
Q5 = CMP-2000-07433-1: N-Channel Enhancement Mode MOSFET, 100 V, -55 to 150 degC, 3-Pin SOT23, RoHS, Tape and Reel; Manufacturer: Diodes Inc; Drain-to-Source Voltage [Vdss]: 100V; Qg Gate Charge: 2.9nC; Rated Power Dissipation: 625mW; Drain-Source On Resistance-Max: 0.7O; Package Description: 3-Pin Small Outline Transistor, Body 2.9 x 1.3 mm, Pitch 0.96 mm; Channel Type: N-Channel; Mounting Technology: SurfaceMount; Datasheet Version: Rev. 6-2, 08/2012; Manufacturer URL: http://www.diodes.com/; Datasheet URL: http://www.diodes.com/_files/datasheets/ZXMN10A07F.pdf; Package Reference: SOT23-3
R16-R41 = Res1: Resistor; Published: 8-Jun-2000; LatestRevisionDate: 17-Jul-2002; LatestRevisionNote: Re-released for DXP Platform.; PackageReference: AXIAL-0.3; Publisher: Altium Limited; PackageDescription: Axial Device, Thru-Hole; 2 Leads; 0.3 in Pin Spacing
U1 = CMP-0333-00336-2: Two-Phase Interleaved CCM PFC Controller with Extended Frequency Range (10 kHz to 300 kHz), 21 V, 20 mA Startup Current, -40 to 125 degC, 20-pin TSSOP (PW), Green (RoHS & no Sb/Br); Manufacturer: Texas Instruments; UVLO Thresholds On/Off(V): 10.2/9.2; Practical Operating Frequency(Max)(MHz): 0.3; Vref(V): 6; Average Current Mode: TRUE; Operating Supply(Max)(V): 21; Duty Cycle(Max)(%): 99; Rating: Catalog; Vref tol(%): 3; Operating Supply Current(mA): 20; PackageReference: PW0020A; PartNumber: UCC28070APW; ComponentLink1URL: http://www.ti.com/general/docs/lit/getliterature.tsp?genericPartNumber=UCC28070A&fileType=pdf; Eco-Plan: Green (RoHS & no Sb/Br); Mounting Technology: Surface Mount; PackageVersion: revG, Feb-2011; ComponentLink1Description: Datasheet; Interleaved: TRUE; Code_JEDEC: MO-153; > 750W Applications: TRUE; PackageDescription: 20-Pin Plastic Thin Small Outline Package 6.5 x 4.4 mm Body ,0.65 mm Pitch; Startup Current(mA): 20; OVP: TRUE; DatasheetVersion: SLUSAW0

## Sheet Shut_Down.SchDoc
size A2
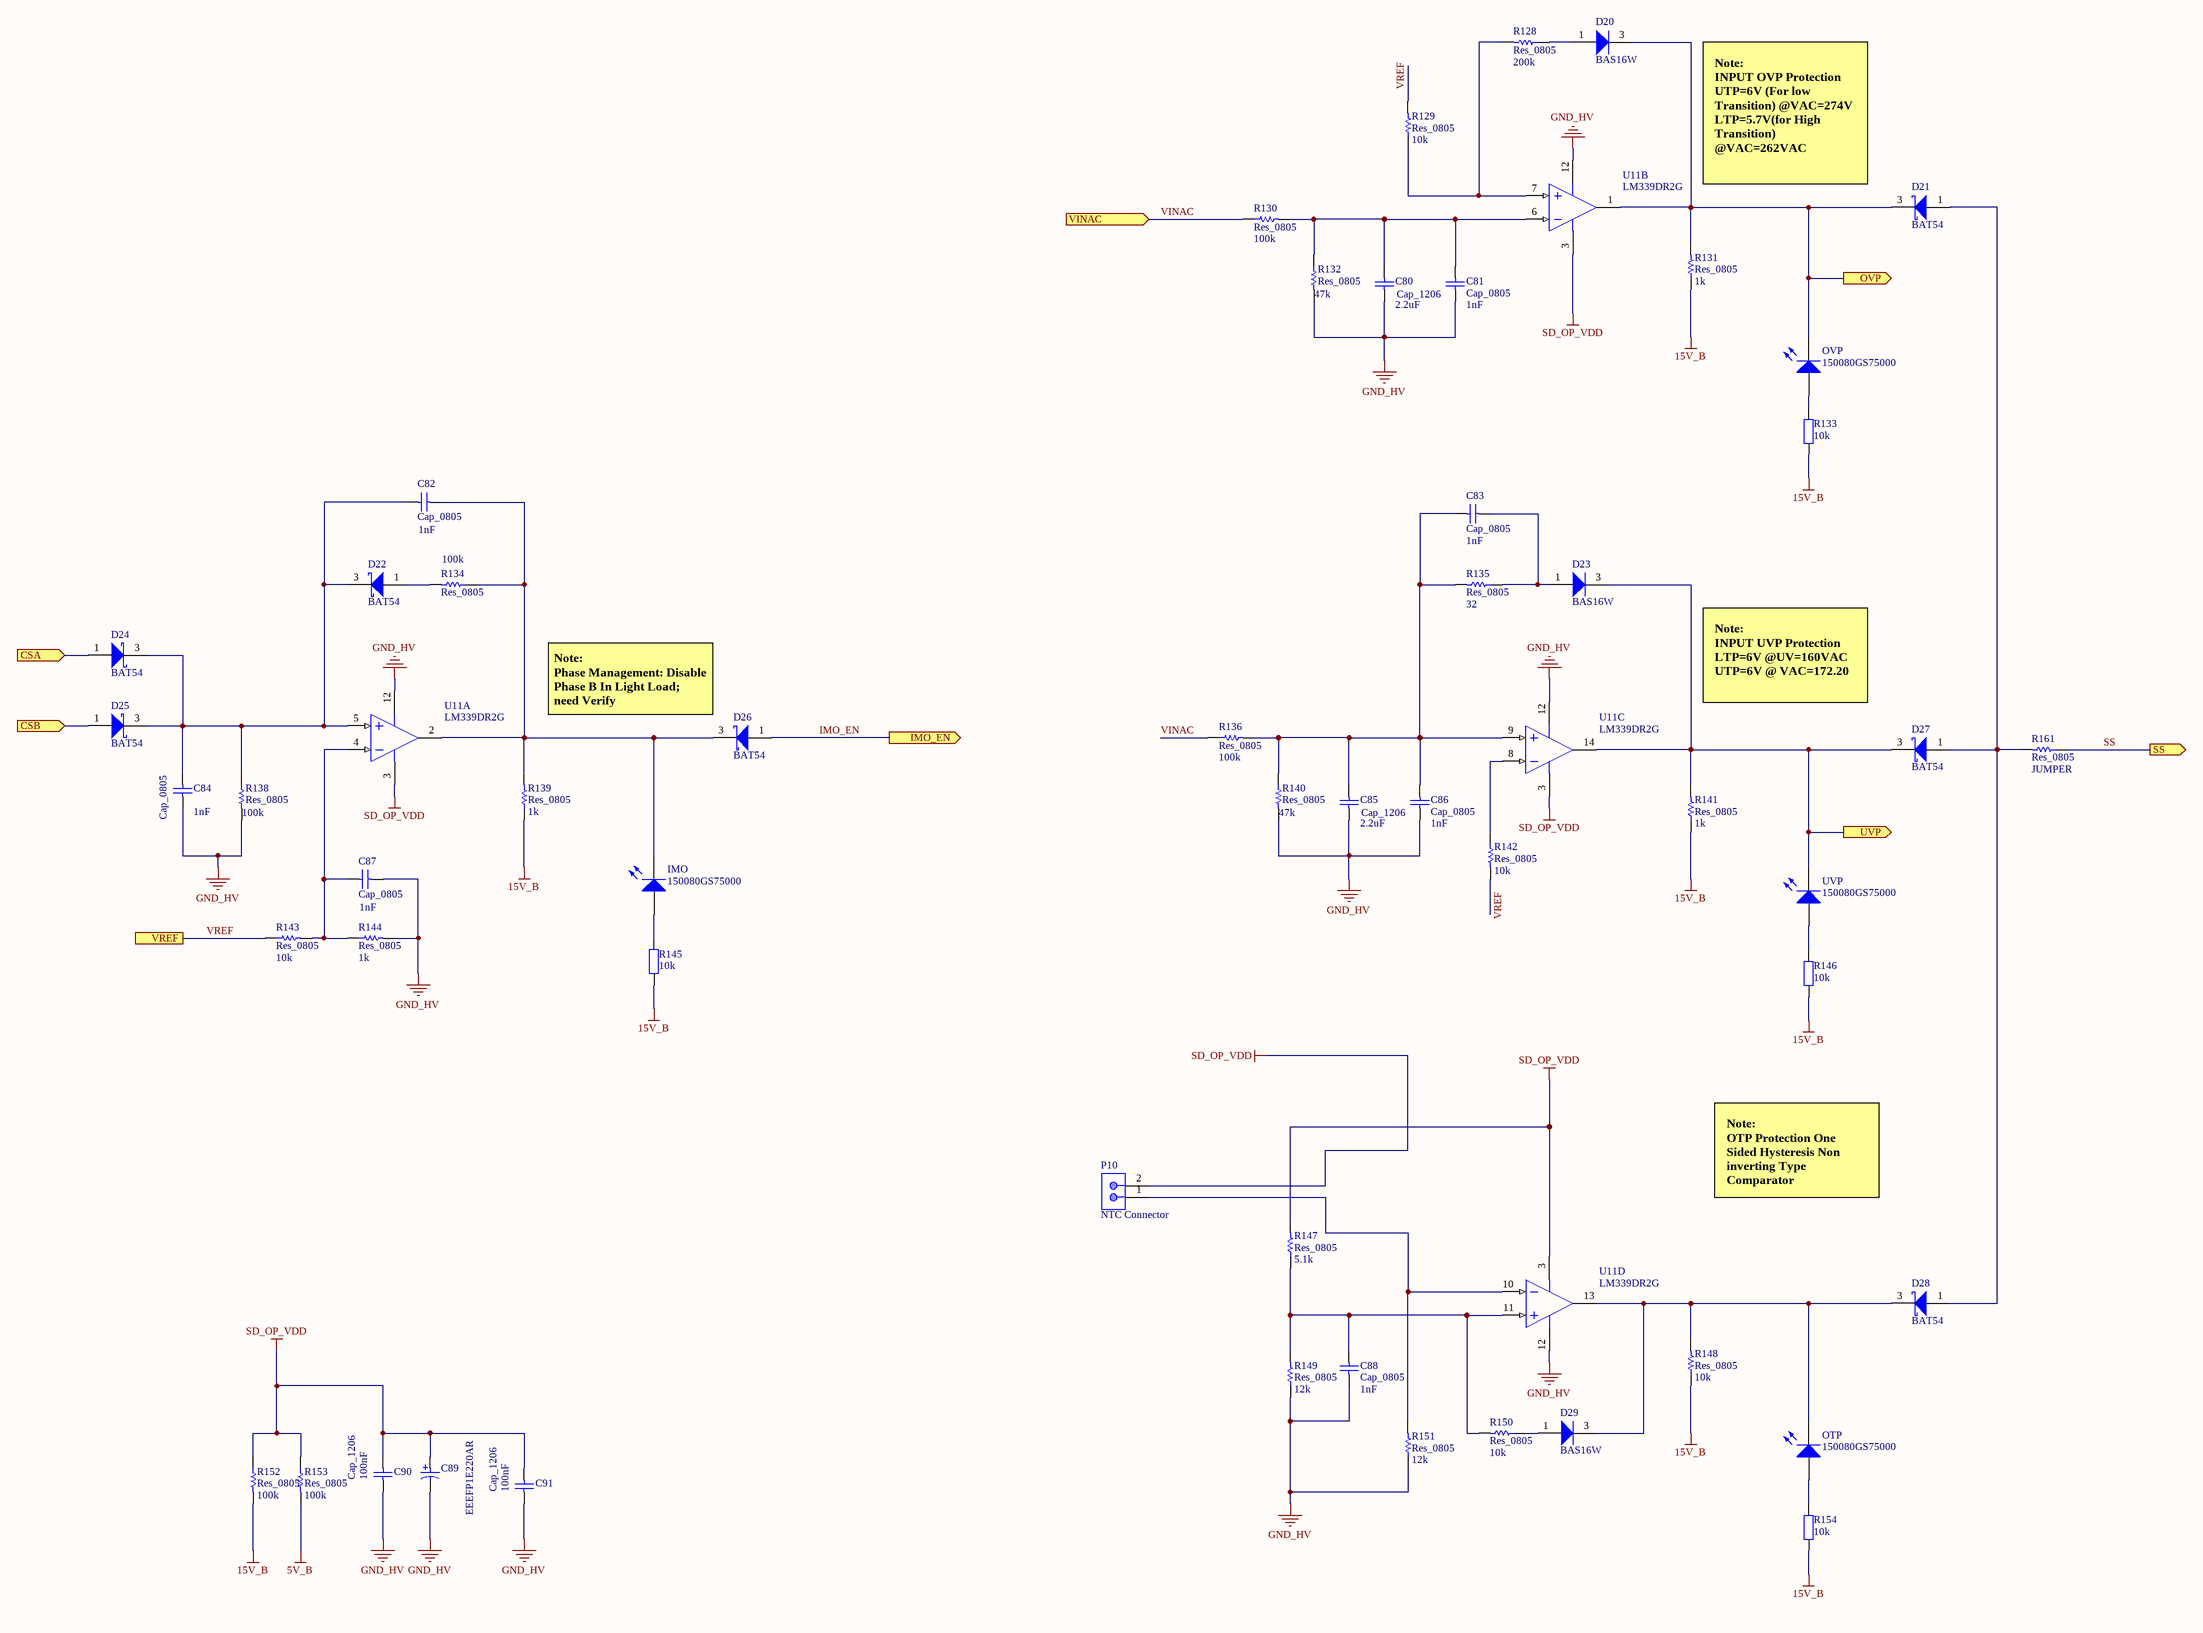
[diagram p3: Shut_Down.SchDoc]

### Parts
(Parts that share a designator on the sheet are numbered #1, #2 ... from top to bottom, then left to right.)
C80  Cap_1206  value 2.2uF  [SMD-1206C]
C81  Cap_0805  Size: 1nF  [SMD-0805C]
C82  Cap_0805  Size: 1nF  [SMD-0805C]
C83  Cap_0805  Size: 1nF  [SMD-0805C]
C84  Cap_0805  Size: 1nF  [SMD-0805C]
C85  Cap_1206  value 2.2uF  [SMD-1206C]
C86  Cap_0805  Size: 1nF  [SMD-0805C]
C87  Cap_0805  Size: 1nF  [SMD-0805C]
C88  Cap_0805  Size: 1nF  [SMD-0805C]
C89  EEEFP1E220AR  [PNSC-FP-V-C_V]
C90  Cap_1206  value 100nF  [SMD-1206C]
C91  Cap_1206  value 100nF  [SMD-1206C]
D20  BAS16W  [SOT95P278X110-3N]
D21  BAT54  [SOT95P278X110-3N]
D22  BAT54  [SOT95P278X110-3N]
D23  BAS16W  [SOT95P278X110-3N]
D24  BAT54  [SOT95P278X110-3N]
D25  BAT54  [SOT95P278X110-3N]
D26  BAT54  [SOT95P278X110-3N]
D27  BAT54  [SOT95P278X110-3N]
D28  BAT54  [SOT95P278X110-3N]
D29  BAS16W  [SOT95P278X110-3N]
IMO  150080GS75000  [0805_A]
OTP  150080GS75000  [0805_A]
OVP  150080GS75000  [0805_A]
P10  NTC Connector  [61900211121]
R128  Res_0805  value 200k  [WRIS-KSKE_0805_H=0.6mm]
R129  Res_0805  value 10k  [WRIS-KSKE_0805_H=0.6mm]
R130  Res_0805  value 100k  [WRIS-KSKE_0805_H=0.6mm]
R131  Res_0805  value 1k  [WRIS-KSKE_0805_H=0.6mm]
R132  Res_0805  value 47k  [WRIS-KSKE_0805_H=0.6mm]
R133  10k  [WRIS-KSKE_0805_H=0.6mm]
R134  Res_0805  value 100k  [WRIS-KSKE_0805_H=0.6mm]
R135  Res_0805  value 32  [WRIS-KSKE_0805_H=0.6mm]
R136  Res_0805  value 100k  [WRIS-KSKE_0805_H=0.6mm]
R138  Res_0805  value 100k  [WRIS-KSKE_0805_H=0.6mm]
R139  Res_0805  value 1k  [WRIS-KSKE_0805_H=0.6mm]
R140  Res_0805  value 47k  [WRIS-KSKE_0805_H=0.6mm]
R141  Res_0805  value 1k  [WRIS-KSKE_0805_H=0.6mm]
R142  Res_0805  value 10k  [WRIS-KSKE_0805_H=0.6mm]
R143  Res_0805  value 10k  [WRIS-KSKE_0805_H=0.6mm]
R144  Res_0805  value 1k  [WRIS-KSKE_0805_H=0.6mm]
R145  10k  [WRIS-KSKE_0805_H=0.6mm]
R146  10k  [WRIS-KSKE_0805_H=0.6mm]
R147  Res_0805  value 5.1k  [WRIS-KSKE_0805_H=0.6mm]
R148  Res_0805  value 10k  [WRIS-KSKE_0805_H=0.6mm]
R149  Res_0805  value 12k  [WRIS-KSKE_0805_H=0.6mm]
R150  Res_0805  value 10k  [WRIS-KSKE_0805_H=0.6mm]
R151  Res_0805  value 12k  [WRIS-KSKE_0805_H=0.6mm]
R152#1  Res_0805  value 100k  [WRIS-KSKE_0805_H=0.6mm]
R153#1  Res_0805  value 100k  [WRIS-KSKE_0805_H=0.6mm]
R154  10k  [WRIS-KSKE_0805_H=0.6mm]
R161  Res_0805  value JUMPER  [WRIS-KSKE_0805_H=0.6mm]
U11  LM339DR2G  [SOIC127P600X265-14N]  (parts A,B,C,D of 4)
UVP  150080GS75000  [0805_A]

### Ports
CSA (in), CSB (in), IMO_EN (out), OVP (out), SS (out), UVP (out), VINAC (in), VREF

### Nets
5V_B: R153#1.2
15V_B: R131.1 R133.1 R139.1 R141.1 R145.1 R146.1 R148.1 R152#1.2 R154.1
GND_HV: C80.2 C81.1 C84.1 C85.2 C86.1 C87.2 C88.1 C89.2 C90.2 C91.2 R132.2 R138.2 R140.2 R144.2 R149.1 R151.1 U11.12(GND)
SD_OP_VDD: C89.1 C90.1 C91.1 P10.2 R147.2 R152#1.1 R153#1.1 U11.3(VCC)
CSA: D24.1(A) ; port CSA
CSB: D25.1(A) ; port CSB
IMO_EN: D26.1(A) ; port IMO_EN
OVP: D20.3(K) D21.3(K) OVP.1(K) R131.2 U11.1(OUT2) ; port OVP
SS: R161.1 ; port SS
UVP: D23.3(K) D27.3(K) R141.2 U11.14(OUT3) UVP.1(K) ; port UVP
VINAC: R130.1 R136.1 ; port VINAC
VREF: R129.2 R142.2 R143.1 ; port VREF
NetC80_1: C80.1 C81.2 R130.2 R132.1 U11.6(IN2-)
NetC82_1: C82.1 C84.2 D22.3(K) D24.3(K) D25.3(K) R138.1 U11.5(IN1+)
NetC82_2: C82.2 D26.3(K) IMO.1(K) R134.1 R139.2 U11.2(OUT1)
NetC83_1: C83.1 D23.1(A) R135.1
NetC83_2: C83.2 C85.1 C86.2 R135.2 R136.2 R140.1 U11.9(IN3+)
NetC87_1: C87.1 R143.2 R144.1 U11.4(IN1-)
NetC88_2: C88.2 R147.1 R149.2 R150.2 U11.11(IN4+)
NetD20_1: D20.1(A) R128.1
NetD21_1: D21.1(A) D27.1(A) D28.1(A) R161.2
NetD22_1: D22.1(A) R134.2
NetD28_3: D28.3(K) D29.3(K) OTP.1(K) R148.2 U11.13(OUT4)
NetD29_1: D29.1(A) R150.1
NetIMO_2: IMO.2(A) R145.2
NetOTP_2: OTP.2(A) R154.2
NetOVP_2: OVP.2(A) R133.2
NetP10_1: P10.1 R151.2 U11.10(IN4-)
NetR128_2: R128.2 R129.1 U11.7(IN2+)
NetR142_1: R142.1 U11.8(IN3-)
NetR146_2: R146.2 UVP.2(A)

### Notes on the sheet
- Note:                                                                                   INPUT OVP Protection                         UTP=6V (For low Transition) @VAC=274V              LTP=5.7V(for High Transition) @VAC=262VAC
- Note:
  INPUT UVP Protection                                               LTP=6V @UV=160VAC UTP=6V @ VAC=172.20
- (near D26) Note:
  Phase Management: Disable Phase B In Light Load; need Verify
- Note:
  OTP Protection One Sided Hysteresis Non inverting Type Comparator

### Library data of the parts
C80 C85 C90 C91 = Cap: Capacitor; Published: 8-Jun-2000; LatestRevisionDate: 17-Jul-2002; LatestRevisionNote: Re-released for DXP Platform.; PackageReference: RAD-0.3; Publisher: Altium Limited; PackageDescription: Radial Cap, Thru-Hole; 2 Leads; 0.3 in Pin Spacing
C81-C84 C86-C88 = Cap: Capacitor; Value: 100pF; Published: 8-Jun-2000; LatestRevisionDate: 17-Jul-2002; LatestRevisionNote: Re-released for DXP Platform.; PackageReference: RAD-0.3; Publisher: Altium Limited; PackageDescription: Radial Cap, Thru-Hole; 2 Leads; 0.3 in Pin Spacing
C89 = CMP-2000-06213-1: as C22 on sheet UCC28070_Control; Package Reference: FP-V-C; Package Description: 2-Pin Electrolytic Aluminum Capacitor, Body 5.3 x 5.3 mm; Operating Temp Range: -55to+105°C; Mounting Technology: SurfaceMount; Datasheet URL: http://industrial.panasonic.com/cdbs/www-data/pdf/RDE0000/ABA0000C1184.pdf; Case Size/Dimension: Ø5x5.8mm; Operating Temp-Max: 105°C; Package URL: http://industrial.panasonic.com/cdbs/www-data/pdf/RDE0000/DME0000COL48.pdf; Datasheet Version: 03/2016; Series: FP; Manufacturer URL: http://www.panasonic.com/
D20 D23 D29 = BAS16: as D8 on sheet UCC28070_Control; Mounting Technology: Surface Mount; PackageReference: SOT323; ComponentLink2URL: http://www.infineon.com/dgdl/bas16series.pdf?folderId=db3a30431400ef6801141b5844e103ea&fileId=db3a30431400ef6801141b93811b03ff; Halogen-free: TRUE; ComponentLink2Description: Datasheet; PartNumber: BAS16W; ComponentLink1Description: Manufacturer URL; ComponentLink3URL: http://www.infineon.com/dgdl/SOT323-Package_Overview.pdf?folderId=db3a30431936bc4b0119533e1dcb3c92&fileId=db3a30431936bc4b011953495f283cb1; ComponentLink1URL: http://www.infineon.com/; PackageDescription: 3-Pin Small Outline Transistor Package, 1.25 x 2 mm Body, 0.65 mm Pitch; ComponentLink3Description: Package Specification
D21 D22 D24-D28 = BAT54: Silicon Switching Diode, SOT323, Reel, Green; PartNumber: BAS16W; Manufacturer: Infineon; IR (max): 100Â nA; Configuration: Single; VBR (min): 85Â V; VR (max): 80Â V; trr (max): 4Â ns; Green: TRUE; VF (max): 1.25Â V; IF (max): 250Â mA; Mounting Technology: Surface Mount; PackageReference: SOT323; ComponentLink2URL: http://www.infineon.com/dgdl/bas16series.pdf?folderId=db3a30431400ef6801141b5844e103ea&fileId=db3a30431400ef6801141b93811b03ff; Halogen-free: TRUE; ComponentLink2Description: Datasheet; ComponentLink1Description: Manufacturer URL; ComponentLink3URL: http://www.infineon.com/dgdl/SOT323-Package_Overview.pdf?folderId=db3a30431936bc4b0119533e1dcb3c92&fileId=db3a30431936bc4b011953495f283cb1; ComponentLink1URL: http://www.infineon.com/; PackageDescription: 3-Pin Small Outline Transistor Package, 1.25 x 2 mm Body, 0.65 mm Pitch; ComponentLink3Description: Package Specification
IMO OTP OVP UVP = 150080GS75000: SMD mono-color Chip LED, WL-SMCW, Green; PackageReference: 0805_A; Color: Green; PartNumber: 150080GS75000; ComponentLink1Description: Manufacturer URL; ComponentLink1URL: http://www.we-online.com; ComponentLink2Description: Datasheet; ComponentLink2URL: http://katalog.we-online.com/led/datasheet/150080GS75000.pdf
P10 = 61900211121: WR-WTB THT Male Vertical Locking Header, pitch 2.54mm, 2p; Pin Number: 2; Contact Resistance: 20mOhm; Rated Current: 3A; Withstanding Voltage: 1000VAC; Working Voltage: 250VAC; ComponentLink1Description: Manufacturer; ComponentLink1URL: http://www.we-online.de; ComponentLink2Description: Datasheet; ComponentLink2URL: https://www.we-online.com/catalog/datasheet/61900211121.pdf; Pitch: 2.54mm; Published Date: January 2020; Publisher: Wurth Elektronik; Mounting Technology: THT; Packaging: Bag; Operating Temperature: -40 to +105degC; Part Number: 61900211121; Gender: Male; Type: Vertical
R128-R132 R134-R136 R138-R144 R147-R151 R152#1 R153#1 R161 = Res1: Resistor; Published: 8-Jun-2000; LatestRevisionDate: 17-Jul-2002; LatestRevisionNote: Re-released for DXP Platform.; PackageReference: AXIAL-0.3; Publisher: Altium Limited; PackageDescription: Axial Device, Thru-Hole; 2 Leads; 0.3 in Pin Spacing
R133 R145 R146 R154 = 560050320001: WRIS-KSKE Thick Film Resistors, size 0805, 0.1Ohm, +/-1%, 0.33W; Rated Current: 1.81A; Temperature Coefficient of Resistance: 250ppm/degC; Technical Reference: KE0805R100F103LAATP0000; ComponentLink1Description: Manufacturer; ComponentLink1URL: http://www.we-online.de; ComponentLink2Description: Datasheet; ComponentLink2URL: https://katalog.we-online.com/pbs/datasheet/560050320001.pdf; Publisher: Wurth Elektronik; Rated Power: 0.33W; Resistance: 0.1Ohm; Mounting Technology: SMT; Height: 0.6mm; Part Number: 560050320001; Packaging: Tape and Reel; Published Date: September 2019; Size: 0805; Length: 2mm; Operating Temperature: -55 to +155degC; Resistance Tolerance: +/-1%; Width: 1.25mm
U11 = LM339: Single Supply Quad Comparators, 0 to 70 degC, 14-Pin SOIC, Pb-Free, Tape and Reel; Manufacturer: On Semiconductor; IO Typ (mA): 16; ComponentLink3URL: http://www.onsemi.com/pub_link/Collateral/751A-03.PDF; RoHS: TRUE; Packing: Tape and Reel; ComponentLink2Description: Datasheet; ComponentLink2URL: http://www.onsemi.com/pub_link/Collateral/LM339-D.PDF; ComponentLink1Description: Manufacturer URL; PackageVersion: Rev. K, 05/2011; DatasheetVersion: Rev. 20; PackageReference: SOIC-14-751A-03; ComponentLink1URL: http://www.onsemi.com/; PartNumber: LM339DR2G; PackageDescription: 14-Pin Small Outline Integrated Circuit, Body 8.65 x 3.9 mm, Pitch 1.27 mm; ComponentLink3Description: Package Specification; Mounting Technology: Surface Mount

## Sheet Current_Sense_1.SchDoc
size A3; DocumentNumber: 6; SheetNumber: 6; SheetTotal: 10
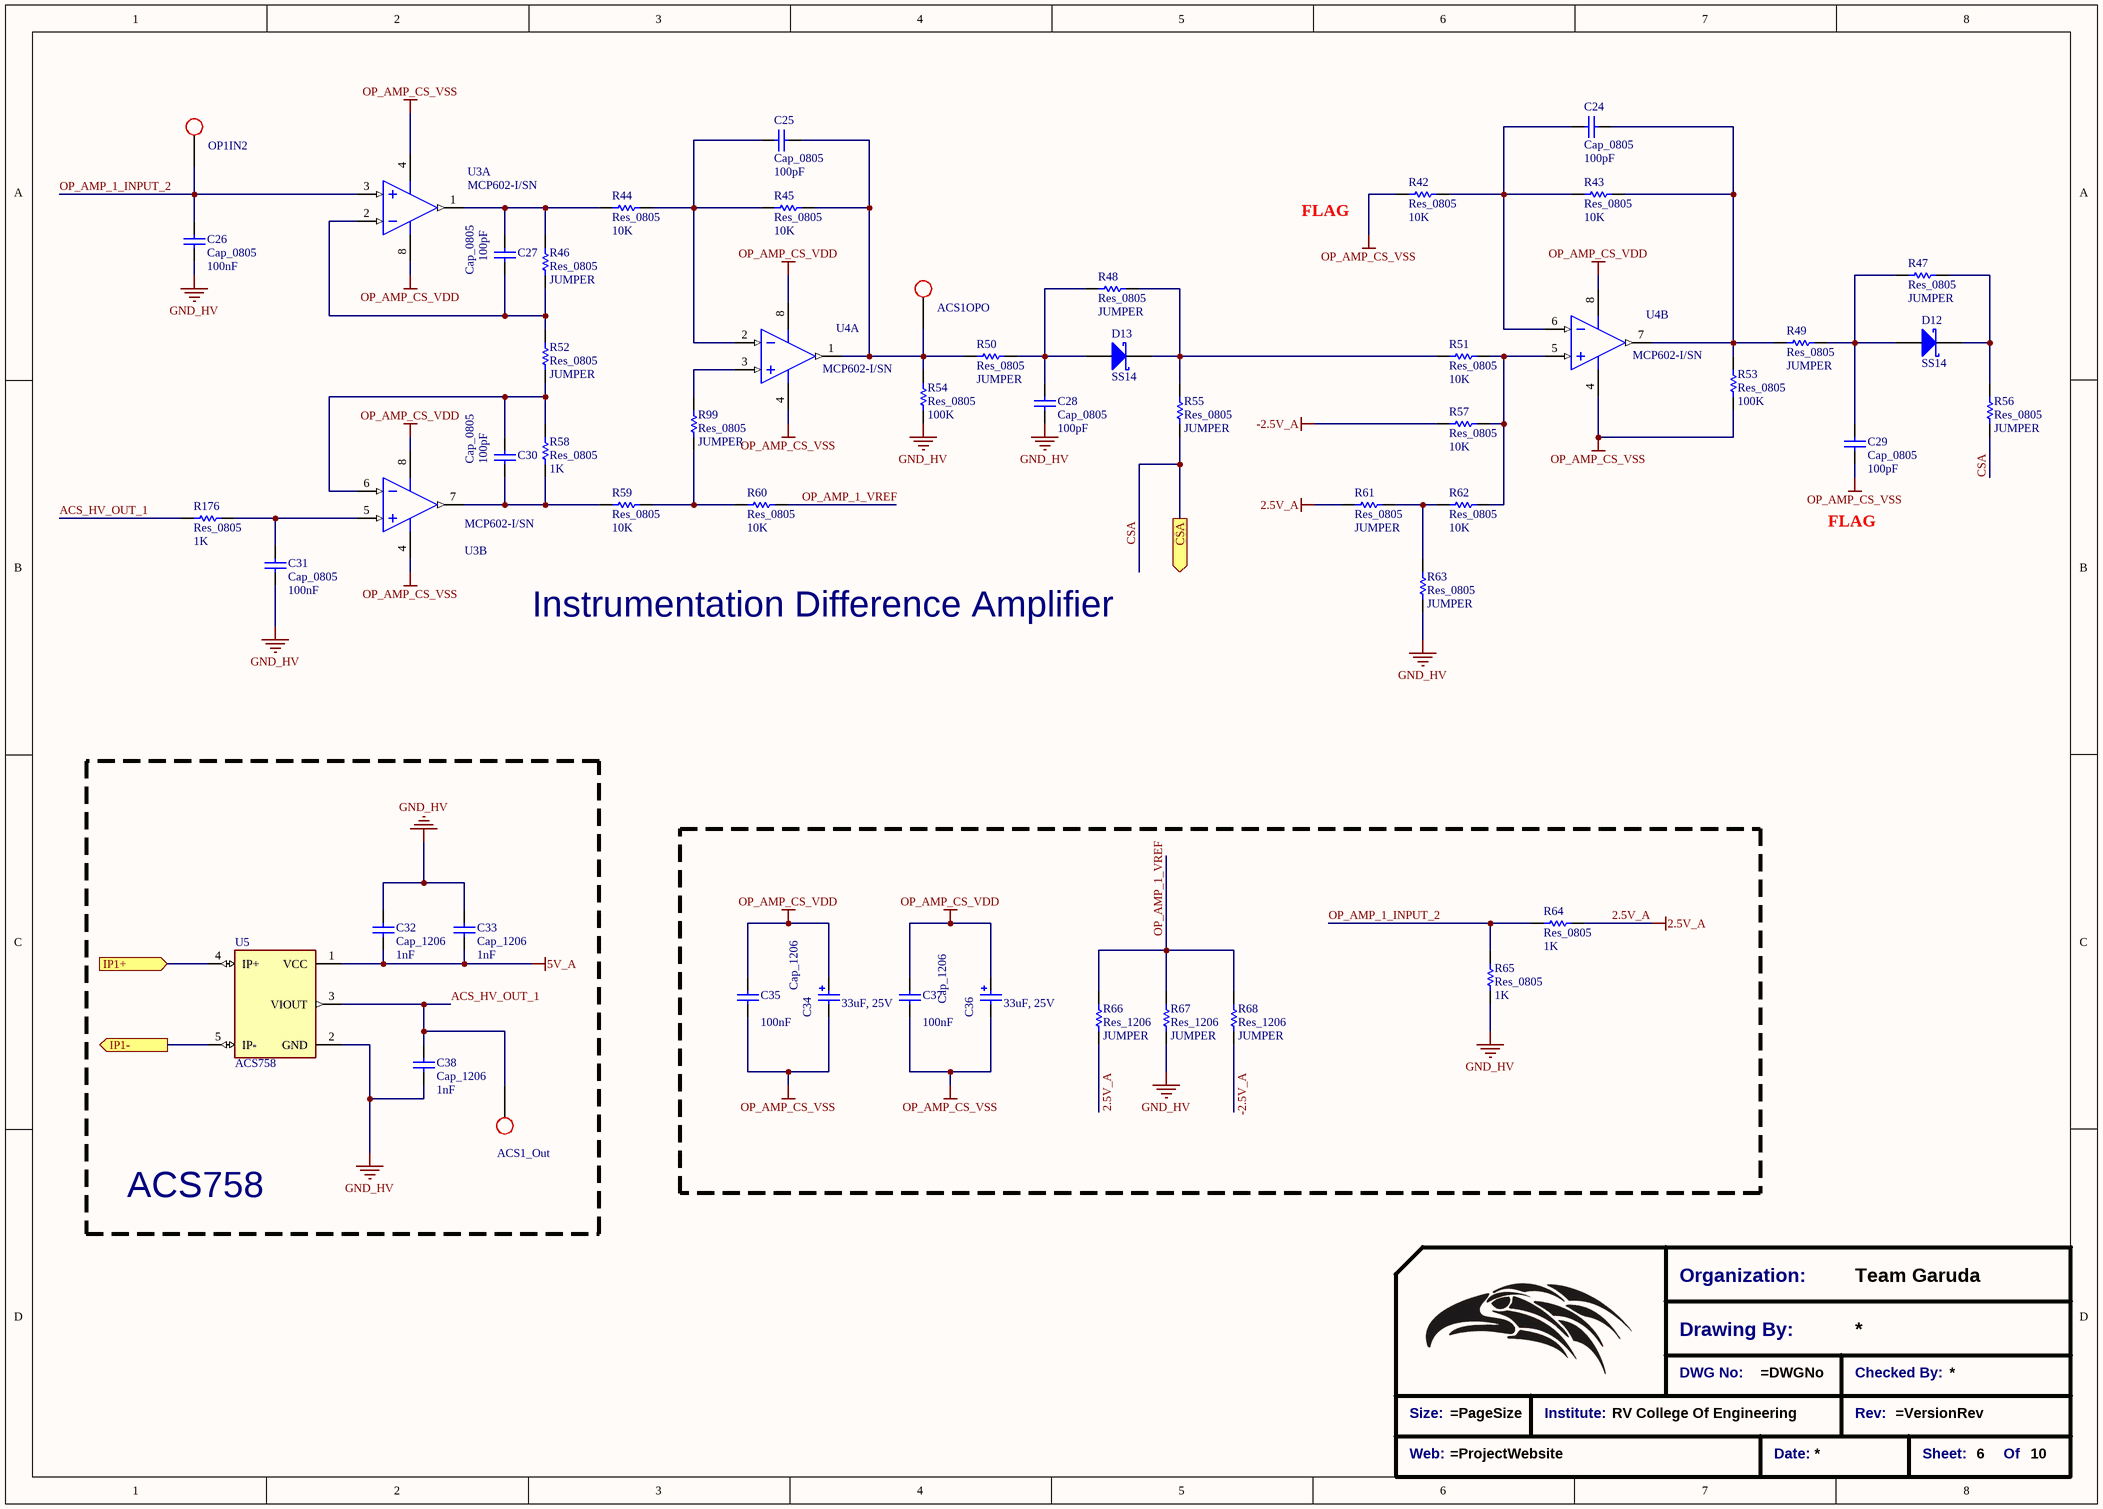
[diagram p4: Current_Sense_1.SchDoc]

### Parts
(Parts that share a designator on the sheet are numbered #1, #2 ... from top to bottom, then left to right.)
*?#1  Title_Block  (value not drawn)  (graphical)
ACS1_Out  Test Point  [Test_point_SMD]  (value not drawn)  (no BOM)
ACS1OPO  Test Point  [Test_point_SMD]  (value not drawn)  (no BOM)
C24  Cap_0805  value 100pF  [SMD-0805C]
C25  Cap_0805  value 100pF  [SMD-0805C]
C26  Cap_0805  value 100nF  [SMD-0805C]
C27  Cap_0805  value 100pF  [SMD-0805C]
C28  Cap_0805  value 100pF  [SMD-0805C]
C29  Cap_0805  value 100pF  [SMD-0805C]
C30  Cap_0805  value 100pF  [SMD-0805C]
C31  Cap_0805  value 100nF  [SMD-0805C]
C32  Cap_1206  value 1nF  [SMD-1206C]
C33  Cap_1206  value 1nF  [SMD-1206C]
C34  33uF, 25V  [WCAP-ASLL_6.3x5.5]
C35  Cap_1206  value 100nF  [SMD-1206C]
C36  33uF, 25V  [WCAP-ASLL_6.3x5.5]
C37  Cap_1206  value 100nF  [SMD-1206C]
C38  Cap_1206  value 1nF  [SMD-1206C]
D12  SS14  [DIOM4226X22N]
D13  SS14  [DIOM4226X22N]
OP1IN2  Test Point  [Test_point_SMD]  (value not drawn)  (no BOM)
R42  Res_0805  value 10K  [WRIS-KSKE_0805_H=0.6mm]
R43  Res_0805  value 10K  [WRIS-KSKE_0805_H=0.6mm]
R44  Res_0805  value 10K  [WRIS-KSKE_0805_H=0.6mm]
R45  Res_0805  value 10K  [WRIS-KSKE_0805_H=0.6mm]
R46  Res_0805  value JUMPER  [WRIS-KSKE_0805_H=0.6mm]
R47  Res_0805  value JUMPER  [WRIS-KSKE_0805_H=0.6mm]
R48  Res_0805  value JUMPER  [WRIS-KSKE_0805_H=0.6mm]
R49  Res_0805  value JUMPER  [WRIS-KSKE_0805_H=0.6mm]
R50  Res_0805  value JUMPER  [WRIS-KSKE_0805_H=0.6mm]
R51  Res_0805  value 10K  [WRIS-KSKE_0805_H=0.6mm]
R52  Res_0805  value JUMPER  [WRIS-KSKE_0805_H=0.6mm]
R53  Res_0805  value 100K  [WRIS-KSKE_0805_H=0.6mm]
R54  Res_0805  value 100K  [WRIS-KSKE_0805_H=0.6mm]
R55  Res_0805  value JUMPER  [WRIS-KSKE_0805_H=0.6mm]
R56  Res_0805  value JUMPER  [WRIS-KSKE_0805_H=0.6mm]
R57  Res_0805  value 10K  [WRIS-KSKE_0805_H=0.6mm]
R58  Res_0805  value 1K  [WRIS-KSKE_0805_H=0.6mm]
R59  Res_0805  value 10K  [WRIS-KSKE_0805_H=0.6mm]
R60  Res_0805  value 10K  [WRIS-KSKE_0805_H=0.6mm]
R61  Res_0805  value JUMPER  [WRIS-KSKE_0805_H=0.6mm]
R62  Res_0805  value 10K  [WRIS-KSKE_0805_H=0.6mm]
R63  Res_0805  value JUMPER  [WRIS-KSKE_0805_H=0.6mm]
R64  Res_0805  value 1K  [WRIS-KSKE_0805_H=0.6mm]
R65  Res_0805  value 1K  [WRIS-KSKE_0805_H=0.6mm]
R66  Res_1206  value JUMPER  [WRIS-KSKE_1206_H=0.6mm]
R67  Res_1206  value JUMPER  [WRIS-KSKE_1206_H=0.6mm]
R68  Res_1206  value JUMPER  [WRIS-KSKE_1206_H=0.6mm]
R99#1  Res_0805  value JUMPER  [WRIS-KSKE_0805_H=0.6mm]
R176  Res_0805  value 1K  [WRIS-KSKE_0805_H=0.6mm]
U3  MCP602-I/SN  [SOIC127P570X175_HS-9N - No Thermal]  (parts A,B of 2)
U4  MCP602-I/SN  [SOIC127P570X175_HS-9N - No Thermal]  (parts A,B of 2)
U5  ACS758  [XDCR_ACS758]

### Blocks framed on the sheet
ACS758: ACS1_Out C32 C33 C38 U5

### Ports
CSA (out), IP1+ (in), IP1- (out)

### Nets
2.5V_A: R61.1 R64.2 R66.1
5V_A: C32.2 C33.2 U5.1(VCC)
-2.5V_A: R57.2 R68.1
GND_HV: C26.1 C28.1 C31.1 C32.1 C33.1 C38.1 R54.2 R63.1 R65.1 R67.1 U5.2(GND)
OP_AMP_CS_VDD: C34.2(P) C35.2 C36.2(P) C37.2 U3.8(VDD) U4.8(VDD)
OP_AMP_CS_VSS: C29.1 C34.1(N) C35.1 C36.1(N) C37.1 R42.2 R53.2 U3.4(VSS) U4.4(VSS)
ACS_HV_OUT_1: ACS1_Out.1 C38.2 R176.2 U5.3(VIOUT)  [project net ACS_HV_OUT_1_6]
CSA: R55.1 R56.1 ; port CSA
OP_AMP_1_INPUT_2: C26.2 OP1IN2.1 R64.1 R65.2 U3.3(VINA+)  [project net OP_AMP_1_INPUT_2_6]
OP_AMP_1_VREF: R60.1 R66.2 R67.2 R68.2  [project net OP_AMP_1_VREF_6]
NetACS1OPO_1: ACS1OPO.1 C25.2 R45.1 R50.1 R54.1 U4.1(VOUTA)
NetC24_1: C24.1 R42.1 R43.2 U4.6(VINB-)
NetC24_2: C24.2 R43.1 R49.1 R53.1 U4.7(VOUTB)
NetC25_1: C25.1 R44.1 R45.2 U4.2(VINA-)
NetC27_1: C27.1 R46.1 R52.2 U3.2(VINA-)
NetC27_2: C27.2 R44.2 R46.2 U3.1(VOUTA)
NetC28_2: C28.2 D13.2(A) R48.1 R50.2
NetC29_2: C29.2 D12.2(A) R47.1 R49.2
NetC30_1: C30.1 R58.1 R59.2 U3.7(VOUTB)
NetC30_2: C30.2 R52.1 R58.2 U3.6(VINB-)
NetC31_2: C31.2 R176.1 U3.5(VINB+)
NetD2_3: U5.4(IP+) ; port IP1+
NetD12_1: D12.1(K) R47.2 R56.2
NetD13_1: D13.1(K) R48.2 R51.2 R55.2
NetQ1_2: U5.5(IP-) ; port IP1-
NetR51_1: R51.1 R57.1 R62.1 U4.5(VINB+)
NetR59_1: R59.1 R60.2 R99#1.1
NetR61_2: R61.2 R62.2 R63.2
NetR99#1_2: R99#1.2 U4.3(VINA+)

### Notes on the sheet
- FLAG
- Instrumentation Difference Amplifier
- (in symbol Title_Block) Organization:; Team Garuda; Drawing By:; DWG No:; Checked By:; Size:; Institute:; RV College Of Engineering; Rev:; Web:; Date:; Sheet:; Of

### Library data of the parts
*?#1 = Title_Block: Standard Title Block
ACS1_Out ACS1OPO OP1IN2 = Test Point: TP
C24-C33 C35 C37 C38 = Cap: Capacitor; Published: 8-Jun-2000; LatestRevisionDate: 17-Jul-2002; LatestRevisionNote: Re-released for DXP Platform.; PackageReference: RAD-0.3; Publisher: Altium Limited; PackageDescription: Radial Cap, Thru-Hole; 2 Leads; 0.3 in Pin Spacing
C34 C36 = 865060443003: WCAP-ASLL SMT Aluminum Electrolytic Capacitors, D6.3mm x L5.5mm, 33uF, +/-20%, 25VDC; Dissipation Factor: 14%; Endurance: 2000h; Leakage Current: 8.25uA; Ripple Current max.: 230mA; Technical Reference: ASED055330M025DVCTBB000; ComponentLink1Description: Manufacturer; ComponentLink1URL: http://www.we-online.de; ComponentLink2Description: Datasheet; ComponentLink2URL: https://katalog.we-online.com/pbs/datasheet/865060443003.pdf; Length: 5.5mm; Mounting Technology: SMT; Operating Temperature: -55 to +105degC; Packaging: Tape and Reel; Published Date: August 2019; Capacitance: 33uF; Diameter: 6.3mm; Part Number: 865060443003; Publisher: Wurth Elektronik; Capacitance Tolerance: +/-20%; Rated Voltage: 25VDC
D12 D13 = SS14: Schottky Rectifier, 1.1 W, -65 to 125 degC, 2-Pin SMD, RoHS, Tape and Reel; Manufacturer: Fairchild; Configuration: SINGLE; Diode Element Material: SILICON; Power Dissipation Limit-Max (W): 1.1; Additional Feature: FREEWHEELINGDIODE; Signal Diode Type: SIGNALDIODE; Number of Elements: 1; JEDEC-95 Code: DO-214AC; Rep Pk Reverse Voltage-Max (V): 40; Package Body Material: PLASTIC/EPOXY; CAGE Code: 1HBD3,07933,59621,7D893; Peak Reflow Temperature (Cel): 260; Package Shape: RECTANGULAR; Manufacturer URL: https://www.fairchildsemi.com/; JESD-97 Code: e3; Package Reference: DO-214AC-2; RoHS Compliant: YES; Package Description: 2-Pin Surface Mount Device, Body 4.375 x 2.725 mm; Technology: SCHOTTKY; Surface Mount: YES; Datasheet URL: http://www.onlinecomponents.com/datasheet/ss14.aspx?p=11369800; Terminal Form: CBEND; Package Style: SMALLOUTLINE; Number of Terminals: 2; JESD-30 Code: R-PDSO-C2; Average Forward Current-Max (A): 1; Terminal Finish: MATTETIN; Datasheet Version: Oct-13; Terminal Position: DUAL; Package URL: https://www.fairchildsemi.com/package-drawings/DO/DO214AC.pdf; Moisture Sensitivity Level: 1; Lead Free: YES
R42-R68 R99#1 R176 = Res1: Resistor; Published: 8-Jun-2000; LatestRevisionDate: 17-Jul-2002; LatestRevisionNote: Re-released for DXP Platform.; PackageReference: AXIAL-0.3; Publisher: Altium Limited; PackageDescription: Axial Device, Thru-Hole; 2 Leads; 0.3 in Pin Spacing
U3 U4 = MCP602_2: 2.7V to 6.0V Single Supply CMOS Operational Amplifier, 8-Pin SOIC, Industrial Temperature; ComponentLink1URL: http://www.microchip.com/; ComponentLink1Description: Manufacturer URL; RevisionNote: URLs added.; PackageReference: SOIC-SN8; ComponentLink2URL: http://ww1.microchip.com/downloads/en/DeviceDoc/21314g.pdf; ComponentLink3URL: http://www.microchip.com/stellent/groups/techpub_sg/documents/packagingspec/en012702.pdf; PackageDescription: 8-Lead Plastic Small Outline (SN) - Narrow, 3.90mm Body [SOIC]; DatasheetVersion: revG, Dec-2007; ComponentLink2Description: Datasheet; ComponentLink3Description: Package Specification; Code_IPC: SOIC127P600-8; Code_JEDEC: MS-012; PackageVersion: revBB, Aug-2009
U5 = ACS758: Current Sensor 50A 1 Channel Hall Effect, Open Loop Unidirectional 5-CB Formed Leads, PFF; MF: Allegro MicroSystems LLC; Package: 5-CB-5 Allegro MicroSystems LLC; MP: ACS758; Availability: Unavailable; Price: None; Value: *; SnapEDA_Link: https://www.snapeda.com/parts/ACS758/Allegro%20MicroSystems%20LLC/view-part/226237/?ref=snap

## Sheet Current_Sense_2.SchDoc
size A3
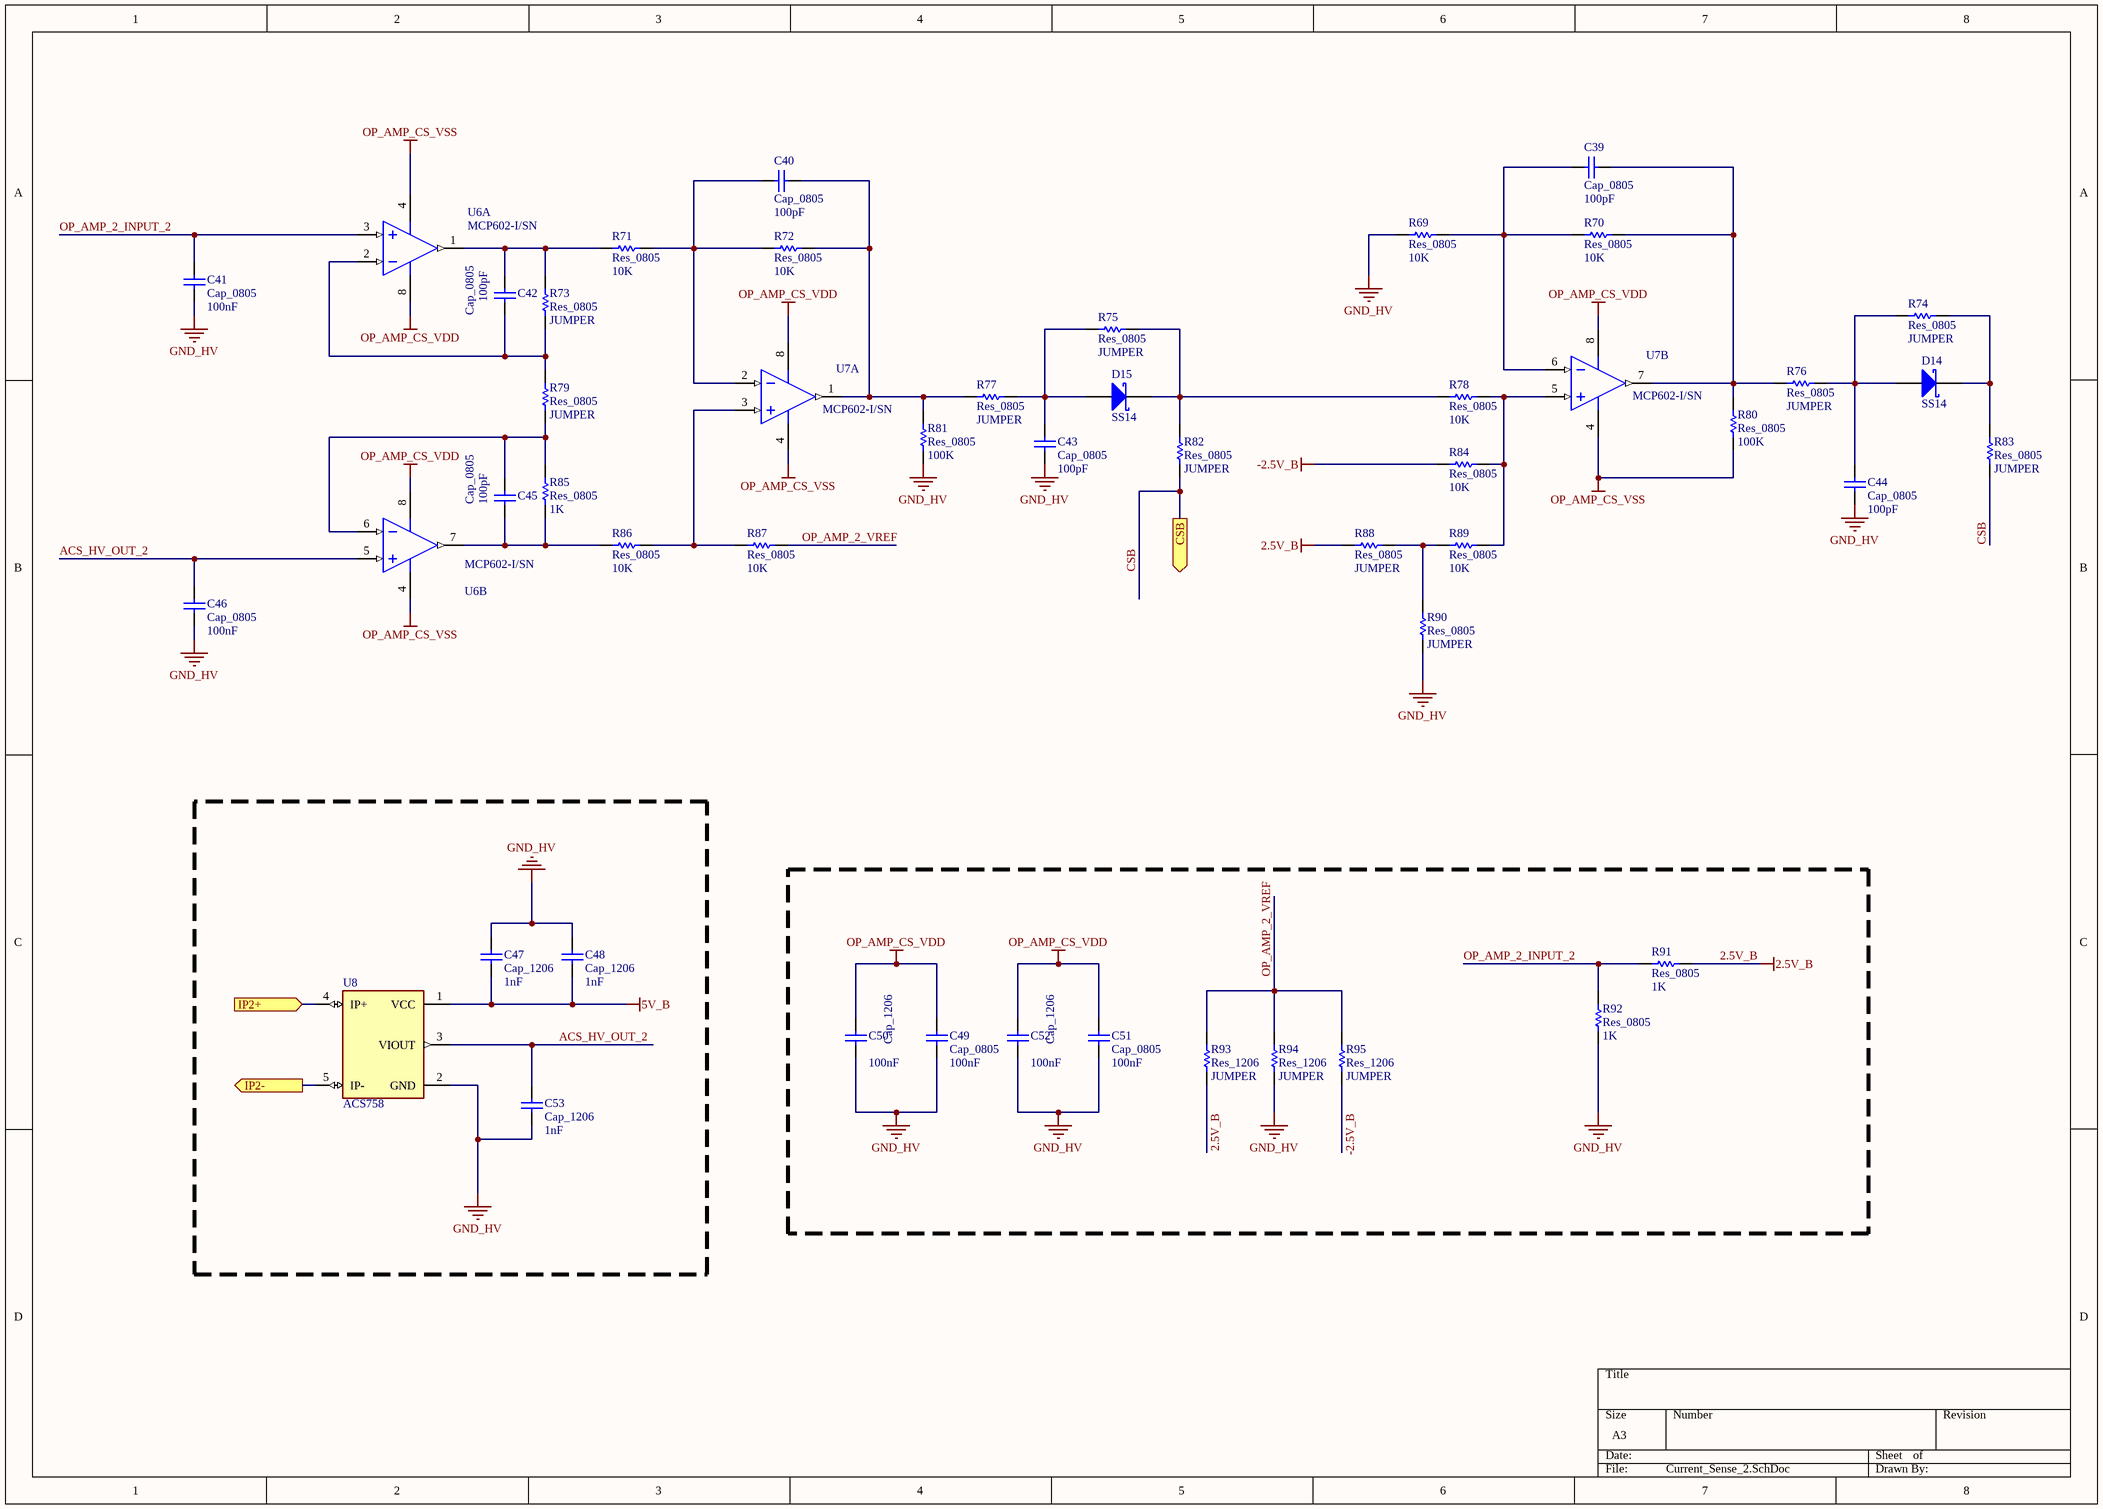
[diagram p5: Current_Sense_2.SchDoc]

### Parts
C39  Cap_0805  value 100pF  [SMD-0805C]
C40  Cap_0805  value 100pF  [SMD-0805C]
C41  Cap_0805  value 100nF  [SMD-0805C]
C42  Cap_0805  value 100pF  [SMD-0805C]
C43  Cap_0805  value 100pF  [SMD-0805C]
C44  Cap_0805  value 100pF  [SMD-0805C]
C45  Cap_0805  value 100pF  [SMD-0805C]
C46  Cap_0805  value 100nF  [SMD-0805C]
C47  Cap_1206  value 1nF  [SMD-1206C]
C48  Cap_1206  value 1nF  [SMD-1206C]
C49  Cap_0805  value 100nF  [SMD-0805C]
C50  Cap_1206  value 100nF  [SMD-1206C]
C51  Cap_0805  value 100nF  [SMD-0805C]
C52  Cap_1206  value 100nF  [SMD-1206C]
C53  Cap_1206  value 1nF  [SMD-1206C]
D14  SS14  [DIOM4226X22N]
D15  SS14  [DIOM4226X22N]
R69  Res_0805  value 10K  [WRIS-KSKE_0805_H=0.6mm]
R70  Res_0805  value 10K  [WRIS-KSKE_0805_H=0.6mm]
R71  Res_0805  value 10K  [WRIS-KSKE_0805_H=0.6mm]
R72  Res_0805  value 10K  [WRIS-KSKE_0805_H=0.6mm]
R73  Res_0805  value JUMPER  [WRIS-KSKE_0805_H=0.6mm]
R74  Res_0805  value JUMPER  [WRIS-KSKE_0805_H=0.6mm]
R75  Res_0805  value JUMPER  [WRIS-KSKE_0805_H=0.6mm]
R76  Res_0805  value JUMPER  [WRIS-KSKE_0805_H=0.6mm]
R77  Res_0805  value JUMPER  [WRIS-KSKE_0805_H=0.6mm]
R78  Res_0805  value 10K  [WRIS-KSKE_0805_H=0.6mm]
R79  Res_0805  value JUMPER  [WRIS-KSKE_0805_H=0.6mm]
R80  Res_0805  value 100K  [WRIS-KSKE_0805_H=0.6mm]
R81  Res_0805  value 100K  [WRIS-KSKE_0805_H=0.6mm]
R82  Res_0805  value JUMPER  [WRIS-KSKE_0805_H=0.6mm]
R83  Res_0805  value JUMPER  [WRIS-KSKE_0805_H=0.6mm]
R84  Res_0805  value 10K  [WRIS-KSKE_0805_H=0.6mm]
R85  Res_0805  value 1K  [WRIS-KSKE_0805_H=0.6mm]
R86  Res_0805  value 10K  [WRIS-KSKE_0805_H=0.6mm]
R87  Res_0805  value 10K  [WRIS-KSKE_0805_H=0.6mm]
R88  Res_0805  value JUMPER  [WRIS-KSKE_0805_H=0.6mm]
R89  Res_0805  value 10K  [WRIS-KSKE_0805_H=0.6mm]
R90  Res_0805  value JUMPER  [WRIS-KSKE_0805_H=0.6mm]
R91  Res_0805  value 1K  [WRIS-KSKE_0805_H=0.6mm]
R92  Res_0805  value 1K  [WRIS-KSKE_0805_H=0.6mm]
R93  Res_1206  value JUMPER  [WRIS-KSKE_1206_H=0.6mm]
R94  Res_1206  value JUMPER  [WRIS-KSKE_1206_H=0.6mm]
R95  Res_1206  value JUMPER  [WRIS-KSKE_1206_H=0.6mm]
U6  MCP602-I/SN  [SOIC127P570X175_HS-9N - No Thermal]  (parts A,B of 2)
U7  MCP602-I/SN  [SOIC127P570X175_HS-9N - No Thermal]  (parts A,B of 2)
U8  ACS758  [XDCR_ACS758]

### Ports
CSB (out), IP2+ (in), IP2- (out)

### Nets
2.5V_B: R88.1 R91.2 R93.1
5V_B: C47.2 C48.2 U8.1(VCC)
-2.5V_B: R84.2 R95.1
GND_HV: C41.1 C43.1 C44.1 C46.1 C47.1 C48.1 C49.1 C50.1 C51.1 C52.1 C53.1 R69.2 R81.2 R90.1 R92.1 R94.1 U8.2(GND)
OP_AMP_CS_VDD: C49.2 C50.2 C51.2 C52.2 U6.8(VDD) U7.8(VDD)
OP_AMP_CS_VSS: R80.2 U6.4(VSS) U7.4(VSS)
ACS_HV_OUT_2: C46.2 C53.2 U6.5(VINB+) U8.3(VIOUT)
CSB: R82.1 R83.1 ; port CSB
OP_AMP_2_INPUT_2: C41.2 R91.1 R92.2 U6.3(VINA+)
OP_AMP_2_VREF: R87.1 R93.2 R94.2 R95.2
NetC39_1: C39.1 R69.1 R70.2 U7.6(VINB-)
NetC39_2: C39.2 R70.1 R76.1 R80.1 U7.7(VOUTB)
NetC40_1: C40.1 R71.1 R72.2 U7.2(VINA-)
NetC40_2: C40.2 R72.1 R77.1 R81.1 U7.1(VOUTA)
NetC42_1: C42.1 R73.1 R79.2 U6.2(VINA-)
NetC42_2: C42.2 R71.2 R73.2 U6.1(VOUTA)
NetC43_2: C43.2 D15.2(A) R75.1 R77.2
NetC44_2: C44.2 D14.2(A) R74.1 R76.2
NetC45_1: C45.1 R85.1 R86.2 U6.7(VOUTB)
NetC45_2: C45.2 R79.1 R85.2 U6.6(VINB-)
NetD5_3: U8.4(IP+) ; port IP2+
NetD14_1: D14.1(K) R74.2 R83.2
NetD15_1: D15.1(K) R75.2 R78.2 R82.2
NetQ3_2: U8.5(IP-) ; port IP2-
NetR78_1: R78.1 R84.1 R89.1 U7.5(VINB+)
NetR86_1: R86.1 R87.2 U7.3(VINA+)
NetR88_2: R88.2 R89.2 R90.2

### Library data of the parts
C39-C53 = Cap: Capacitor; Published: 8-Jun-2000; LatestRevisionDate: 17-Jul-2002; LatestRevisionNote: Re-released for DXP Platform.; PackageReference: RAD-0.3; Publisher: Altium Limited; PackageDescription: Radial Cap, Thru-Hole; 2 Leads; 0.3 in Pin Spacing
D14 D15 = SS14: as D12 on sheet Current_Sense_1; Peak Reflow Temperature (Cel): 260; Package Shape: RECTANGULAR; Manufacturer URL: https://www.fairchildsemi.com/; JESD-97 Code: e3; Package Reference: DO-214AC-2; RoHS Compliant: YES; Package Description: 2-Pin Surface Mount Device, Body 4.375 x 2.725 mm; Technology: SCHOTTKY; Surface Mount: YES; Datasheet URL: http://www.onlinecomponents.com/datasheet/ss14.aspx?p=11369800; Terminal Form: CBEND; Package Style: SMALLOUTLINE; Number of Terminals: 2; JESD-30 Code: R-PDSO-C2; Average Forward Current-Max (A): 1; Terminal Finish: MATTETIN; Datasheet Version: Oct-13; Terminal Position: DUAL; Package URL: https://www.fairchildsemi.com/package-drawings/DO/DO214AC.pdf; Moisture Sensitivity Level: 1; Lead Free: YES
R69-R95 = Res1: Resistor; Published: 8-Jun-2000; LatestRevisionDate: 17-Jul-2002; LatestRevisionNote: Re-released for DXP Platform.; PackageReference: AXIAL-0.3; Publisher: Altium Limited; PackageDescription: Axial Device, Thru-Hole; 2 Leads; 0.3 in Pin Spacing
U6 U7 = MCP602_2: as U3 on sheet Current_Sense_1; ComponentLink1URL: http://www.microchip.com/; ComponentLink1Description: Manufacturer URL; RevisionNote: URLs added.; PackageReference: SOIC-SN8; ComponentLink2URL: http://ww1.microchip.com/downloads/en/DeviceDoc/21314g.pdf; ComponentLink3URL: http://www.microchip.com/stellent/groups/techpub_sg/documents/packagingspec/en012702.pdf; PackageDescription: 8-Lead Plastic Small Outline (SN) - Narrow, 3.90mm Body [SOIC]; DatasheetVersion: revG, Dec-2007; ComponentLink2Description: Datasheet; ComponentLink3Description: Package Specification; Code_IPC: SOIC127P600-8; Code_JEDEC: MS-012; PackageVersion: revBB, Aug-2009
U8 = ACS758: as U5 on sheet Current_Sense_1; Package: 5-CB-5 Allegro MicroSystems LLC; MP: ACS758; Availability: Unavailable; Price: None; Value: *; SnapEDA_Link: https://www.snapeda.com/parts/ACS758/Allegro%20MicroSystems%20LLC/view-part/226237/?ref=snap